# EAGLE schematic 8BIT_LOGIC_2 (EAGLE 6.5.0)

## Sheet 1 of 16
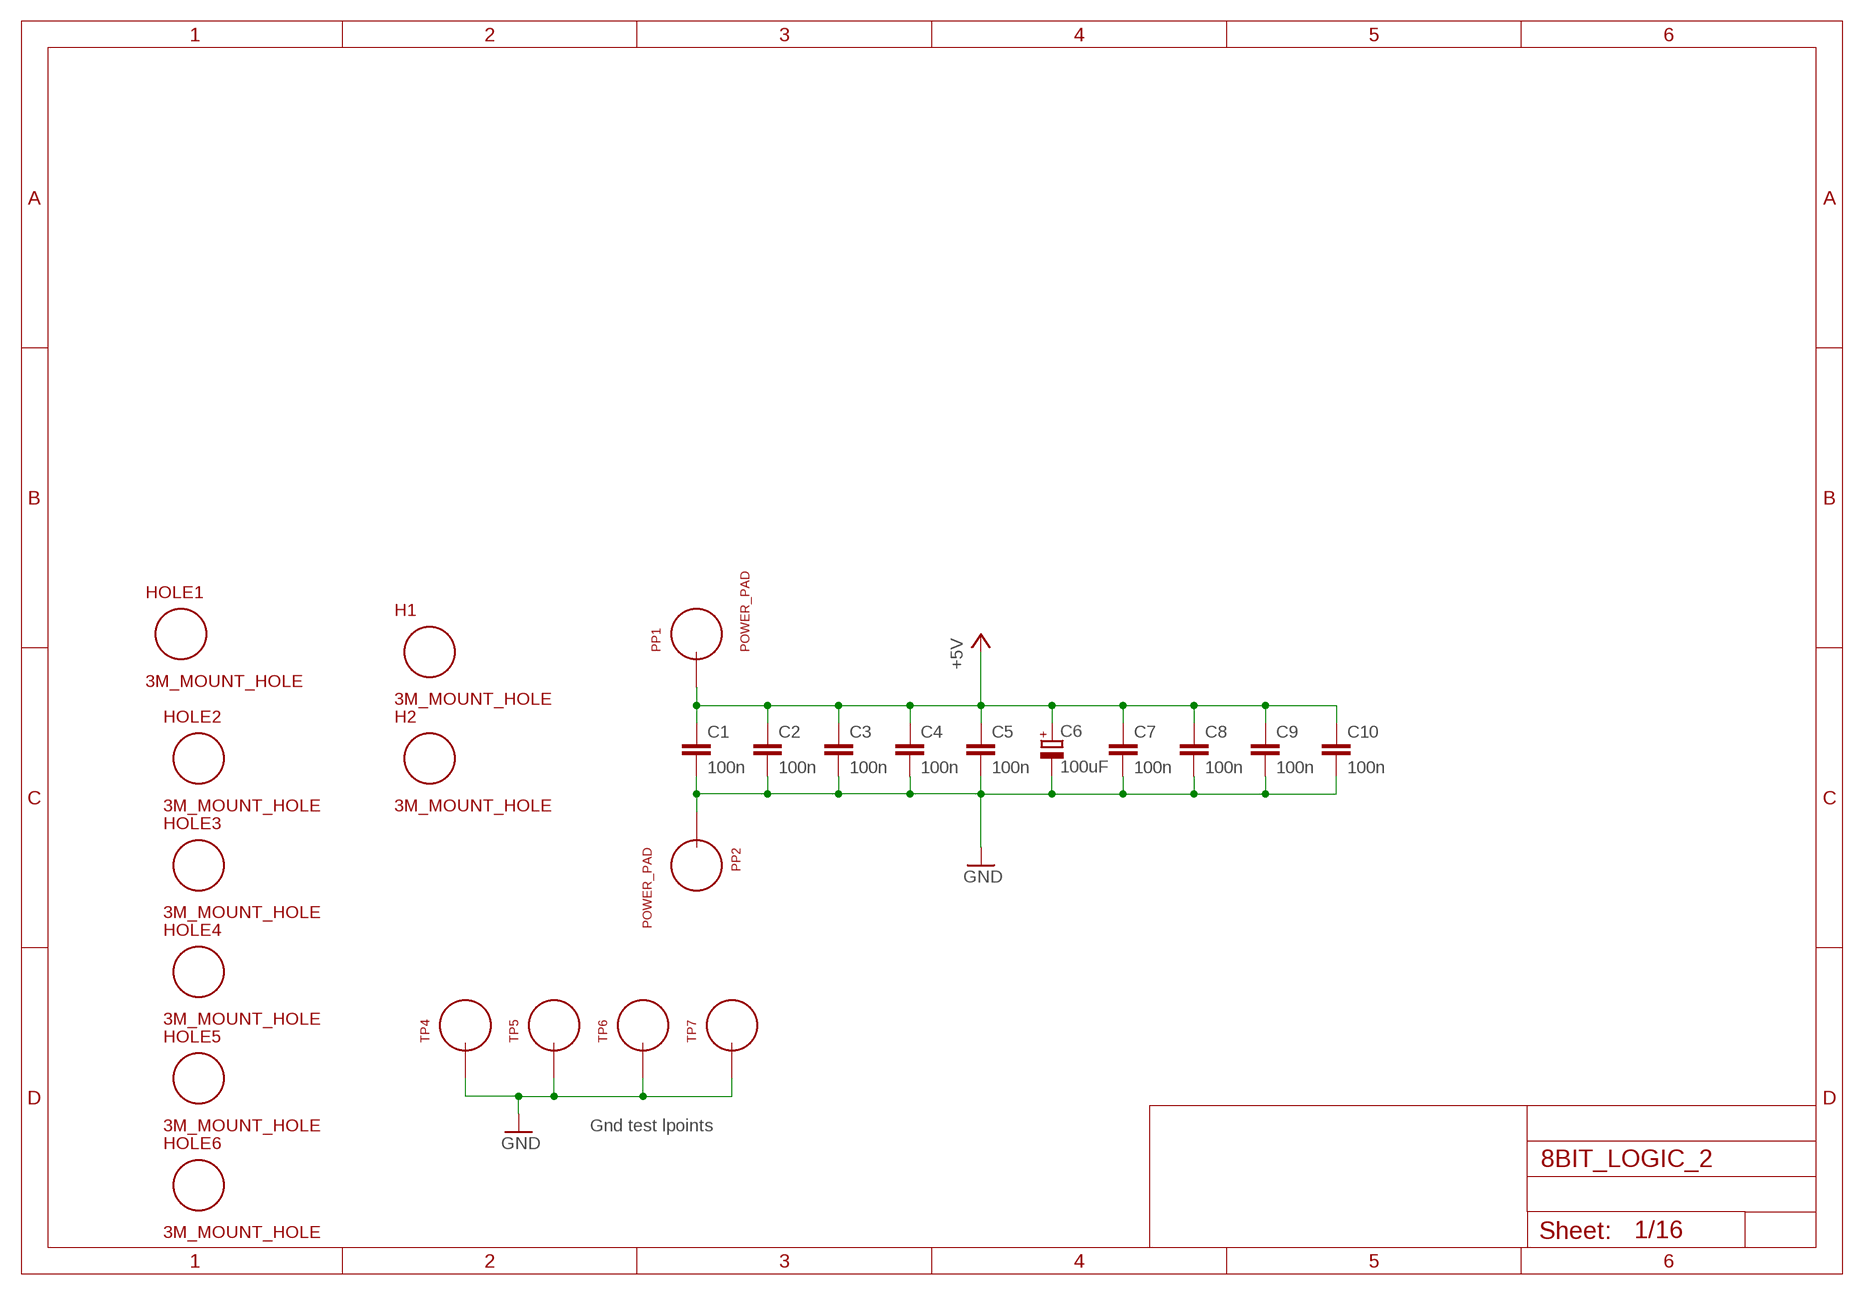
[diagram p0: schematic, sheet 1]

### Parts
C1  100n  C_P2INCH  [CAP_P2INCH]
C2  100n  C_P2INCH  [CAP_P2INCH]
C3  100n  C_P2INCH  [CAP_P2INCH]
C4  100n  C_P2INCH  [CAP_P2INCH]
C5  100n  C_P2INCH  [CAP_P2INCH]
C6  100uF  POLARISED_CAP_2P5  [POLARISED_CAP_2P5]
C7  100n  C_P2INCH  [CAP_P2INCH]
C8  100n  C_P2INCH  [CAP_P2INCH]
C9  100n  C_P2INCH  [CAP_P2INCH]
C10  100n  C_P2INCH  [CAP_P2INCH]
H1  3M_MOUNT_HOLE  [3M_HOLE]
H2  3M_MOUNT_HOLE  [3M_HOLE]
HOLE1  3M_MOUNT_HOLE  [3M_HOLE]
HOLE2  3M_MOUNT_HOLE  [3M_HOLE]
HOLE3  3M_MOUNT_HOLE  [3M_HOLE]
HOLE4  3M_MOUNT_HOLE  [3M_HOLE]
HOLE5  3M_MOUNT_HOLE  [3M_HOLE]
HOLE6  3M_MOUNT_HOLE  [3M_HOLE]
PP1  POWER_PAD  [POWER_PAD]
PP2  POWER_PAD  [POWER_PAD]
TP4  TEST_LOOP  [TEST_LOOP]
TP5  TEST_LOOP  [TEST_LOOP]
TP6  TEST_LOOP  [TEST_LOOP]
TP7  TEST_LOOP  [TEST_LOOP]

### Nets
+5V: C1.1 C2.1 C3.1 C4.1 C5.1 C6.A C7.1 C8.1 C9.1 C10.1 PP1.1 ; also sheet 2,3,4,5,6,7,8,9,10,11,12,14,15,16
GND: C1.2 C2.2 C3.2 C4.2 C5.2 C6.K C7.2 C8.2 C9.2 C10.2 PP2.1 TP4.P$1 TP5.P$1 TP6.P$1 TP7.P$1 ; also sheet 2,3,4,5,6,7,8,9,10,11,12,13,14,15,16

### Notes on the sheet
- Gnd test lpoints

## Sheet 2 of 16
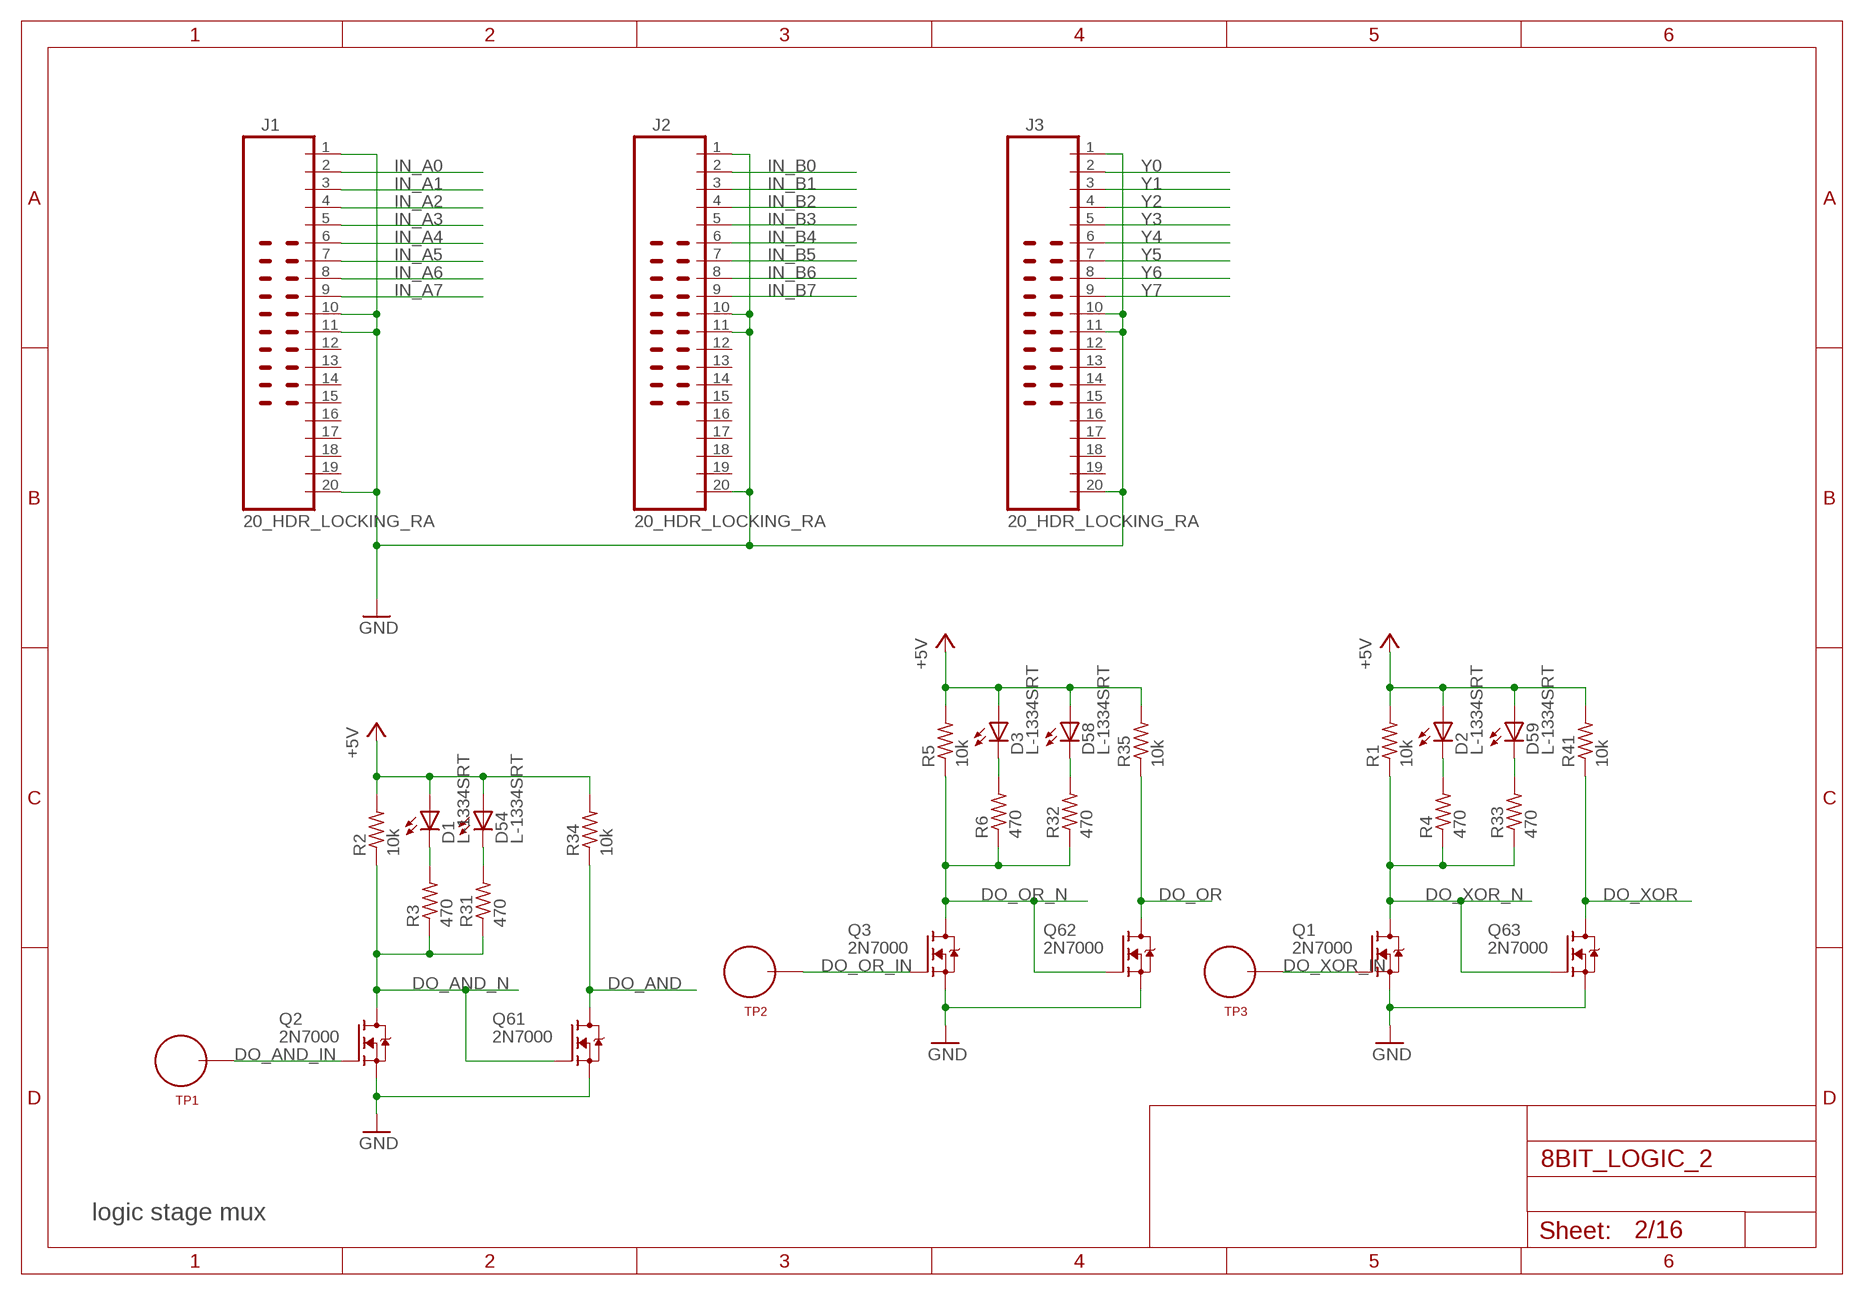
[diagram p1: schematic, sheet 2]

### Parts
D1  L-1334SRT  [LED3MM]
D2  L-1334SRT  [LED3MM]
D3  L-1334SRT  [LED3MM]
D54  L-1334SRT  [LED3MM]
D58  L-1334SRT  [LED3MM]
D59  L-1334SRT  [LED3MM]
J1  20_HDR_LOCKING_RA  [20_HDR_LOCKING_RA]
J2  20_HDR_LOCKING_RA  [20_HDR_LOCKING_RA]
J3  20_HDR_LOCKING_RA  [20_HDR_LOCKING_RA]
Q1  2N7000  [TO92-DGS]
Q2  2N7000  [TO92-DGS]
Q3  2N7000  [TO92-DGS]
Q61  2N7000  [TO92-DGS]
Q62  2N7000  [TO92-DGS]
Q63  2N7000  [TO92-DGS]
R1  10k  R_P2INCH  [R_P2INCH]
R2  10k  R_P2INCH  [R_P2INCH]
R3  470  R_P2INCH  [R_P2INCH]
R4  470  R_P2INCH  [R_P2INCH]
R5  10k  R_P2INCH  [R_P2INCH]
R6  470  R_P2INCH  [R_P2INCH]
R31  470  R_P2INCH  [R_P2INCH]
R32  470  R_P2INCH  [R_P2INCH]
R33  470  R_P2INCH  [R_P2INCH]
R34  10k  R_P2INCH  [R_P2INCH]
R35  10k  R_P2INCH  [R_P2INCH]
R41  10k  R_P2INCH  [R_P2INCH]
TP1  TEST_LOOP  [TEST_LOOP]
TP2  TEST_LOOP  [TEST_LOOP]
TP3  TEST_LOOP  [TEST_LOOP]

### Nets
+5V: D1.A D2.A D3.A D54.A D58.A D59.A R1.2 R2.2 R5.2 R34.2 R35.2 R41.2 ; also sheet 1,3,4,5,6,7,8,9,10,11,12,14,15,16
DO_AND: Q61.D R34.1 ; also sheet 14
DO_AND_IN: Q2.G TP1.P$1
DO_AND_N: Q2.D Q61.G R2.1 R3.1 R31.1
DO_OR: Q62.D R35.1 ; also sheet 16
DO_OR_IN: Q3.G TP2.P$1
DO_OR_N: Q3.D Q62.G R5.1 R6.1 R32.1
DO_XOR: Q63.D R41.1 ; also sheet 15
DO_XOR_IN: Q1.G TP3.P$1
DO_XOR_N: Q1.D Q63.G R1.1 R4.1 R33.1
GND: J1.1 J1.10 J1.11 J1.20 J2.1 J2.10 J2.11 J2.20 J3.1 J3.10 J3.11 J3.20 Q1.S Q2.S Q3.S Q61.S Q62.S Q63.S ; also sheet 1,3,4,5,6,7,8,9,10,11,12,13,14,15,16
IN_A0: J1.2 ; also sheet 3,4,13
IN_A1: J1.3 ; also sheet 3,5,13
IN_A2: J1.4 ; also sheet 3,6,13
IN_A3: J1.5 ; also sheet 3,7,13
IN_A4: J1.6 ; also sheet 3,8,13
IN_A5: J1.7 ; also sheet 3,9,13
IN_A6: J1.8 ; also sheet 3,10,13
IN_A7: J1.9 ; also sheet 3,11,13
IN_B0: J2.2 ; also sheet 3,4,13
IN_B1: J2.3 ; also sheet 3,5,13
IN_B2: J2.4 ; also sheet 3,6,13
IN_B3: J2.5 ; also sheet 3,7,13
IN_B4: J2.6 ; also sheet 3,8,13
IN_B5: J2.7 ; also sheet 3,9,13
IN_B6: J2.8 ; also sheet 3,10,13
IN_B7: J2.9 ; also sheet 3,11,13
N$1: D54.K(C) R31.2
N$2: D58.K(C) R32.2
N$3: D59.K(C) R33.2
N$5: D1.K(C) R3.2
N$6: D2.K(C) R4.2
N$7: D3.K(C) R6.2
Y0: J3.2 ; also sheet 12,13
Y1: J3.3 ; also sheet 12,13
Y2: J3.4 ; also sheet 12,13
Y3: J3.5 ; also sheet 12,13
Y4: J3.6 ; also sheet 12,13
Y5: J3.7 ; also sheet 12,13
Y6: J3.8 ; also sheet 12,13
Y7: J3.9 ; also sheet 12,13
Unconnected: J1.12 J1.13 J1.14 J1.15 J1.16 J1.17 J1.18 J1.19 J2.12 J2.13 J2.14 J2.15 J2.16 J2.17 J2.18 J2.19 J3.12 J3.13 J3.14 J3.15 J3.16 J3.17 J3.18 J3.19

### Notes on the sheet
- logic stage mux

## Sheet 3 of 16
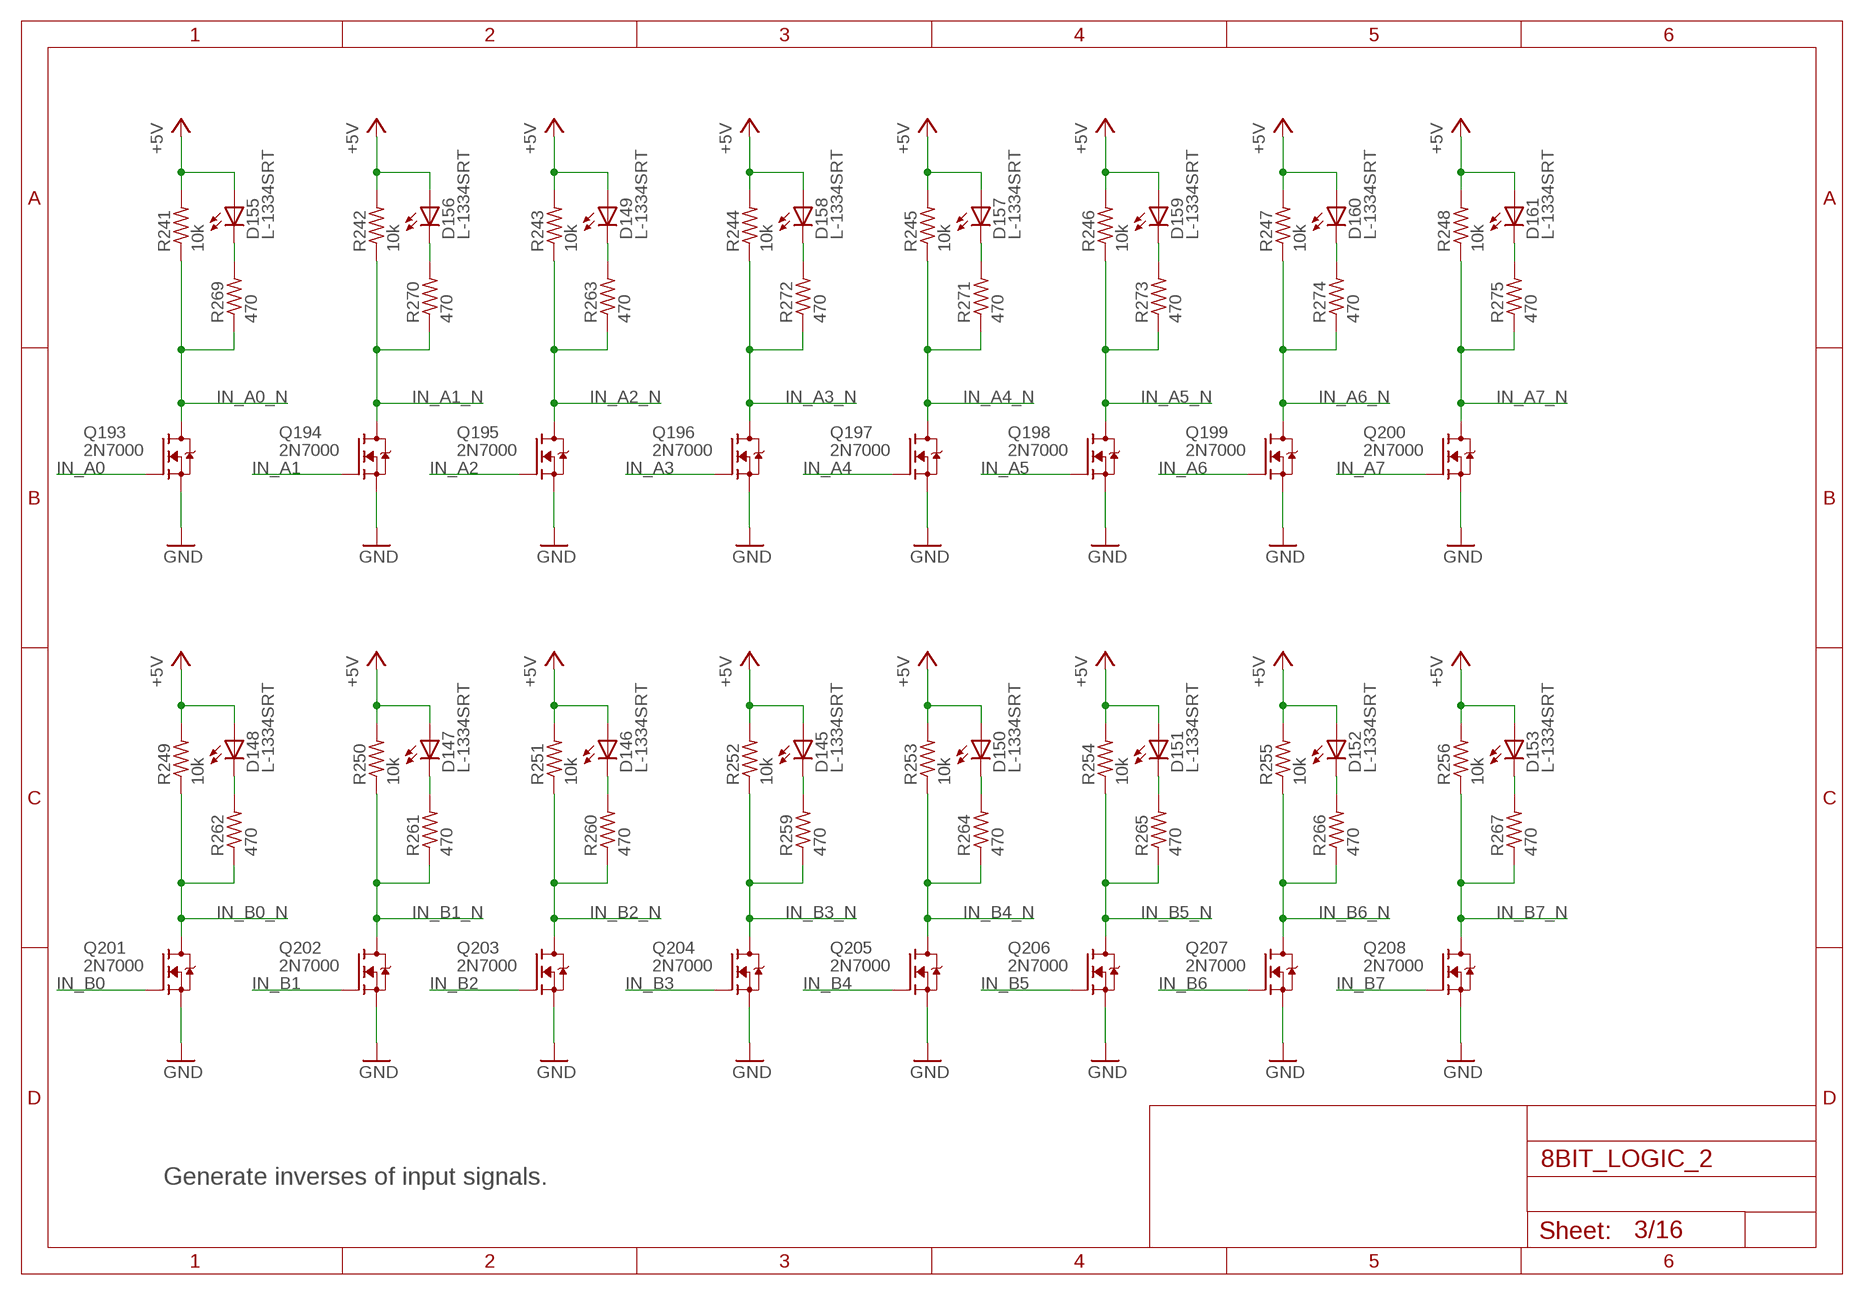
[diagram p2: schematic, sheet 3]

### Parts
D145  L-1334SRT  [LED3MM]
D146  L-1334SRT  [LED3MM]
D147  L-1334SRT  [LED3MM]
D148  L-1334SRT  [LED3MM]
D149  L-1334SRT  [LED3MM]
D150  L-1334SRT  [LED3MM]
D151  L-1334SRT  [LED3MM]
D152  L-1334SRT  [LED3MM]
D153  L-1334SRT  [LED3MM]
D155  L-1334SRT  [LED3MM]
D156  L-1334SRT  [LED3MM]
D157  L-1334SRT  [LED3MM]
D158  L-1334SRT  [LED3MM]
D159  L-1334SRT  [LED3MM]
D160  L-1334SRT  [LED3MM]
D161  L-1334SRT  [LED3MM]
Q193  2N7000  [TO92-DGS]
Q194  2N7000  [TO92-DGS]
Q195  2N7000  [TO92-DGS]
Q196  2N7000  [TO92-DGS]
Q197  2N7000  [TO92-DGS]
Q198  2N7000  [TO92-DGS]
Q199  2N7000  [TO92-DGS]
Q200  2N7000  [TO92-DGS]
Q201  2N7000  [TO92-DGS]
Q202  2N7000  [TO92-DGS]
Q203  2N7000  [TO92-DGS]
Q204  2N7000  [TO92-DGS]
Q205  2N7000  [TO92-DGS]
Q206  2N7000  [TO92-DGS]
Q207  2N7000  [TO92-DGS]
Q208  2N7000  [TO92-DGS]
R241  10k  R_P2INCH  [R_P2INCH]
R242  10k  R_P2INCH  [R_P2INCH]
R243  10k  R_P2INCH  [R_P2INCH]
R244  10k  R_P2INCH  [R_P2INCH]
R245  10k  R_P2INCH  [R_P2INCH]
R246  10k  R_P2INCH  [R_P2INCH]
R247  10k  R_P2INCH  [R_P2INCH]
R248  10k  R_P2INCH  [R_P2INCH]
R249  10k  R_P2INCH  [R_P2INCH]
R250  10k  R_P2INCH  [R_P2INCH]
R251  10k  R_P2INCH  [R_P2INCH]
R252  10k  R_P2INCH  [R_P2INCH]
R253  10k  R_P2INCH  [R_P2INCH]
R254  10k  R_P2INCH  [R_P2INCH]
R255  10k  R_P2INCH  [R_P2INCH]
R256  10k  R_P2INCH  [R_P2INCH]
R259  470  R_P2INCH  [R_P2INCH]
R260  470  R_P2INCH  [R_P2INCH]
R261  470  R_P2INCH  [R_P2INCH]
R262  470  R_P2INCH  [R_P2INCH]
R263  470  R_P2INCH  [R_P2INCH]
R264  470  R_P2INCH  [R_P2INCH]
R265  470  R_P2INCH  [R_P2INCH]
R266  470  R_P2INCH  [R_P2INCH]
R267  470  R_P2INCH  [R_P2INCH]
R269  470  R_P2INCH  [R_P2INCH]
R270  470  R_P2INCH  [R_P2INCH]
R271  470  R_P2INCH  [R_P2INCH]
R272  470  R_P2INCH  [R_P2INCH]
R273  470  R_P2INCH  [R_P2INCH]
R274  470  R_P2INCH  [R_P2INCH]
R275  470  R_P2INCH  [R_P2INCH]

### Nets
+5V: D145.A D146.A D147.A D148.A D149.A D150.A D151.A D152.A D153.A D155.A D156.A D157.A D158.A D159.A D160.A D161.A R241.2 R242.2 R243.2 R244.2 R245.2 R246.2 R247.2 R248.2 R249.2 R250.2 R251.2 R252.2 R253.2 R254.2 R255.2 R256.2 ; also sheet 1,2,4,5,6,7,8,9,10,11,12,14,15,16
GND: Q193.S Q194.S Q195.S Q196.S Q197.S Q198.S Q199.S Q200.S Q201.S Q202.S Q203.S Q204.S Q205.S Q206.S Q207.S Q208.S ; also sheet 1,2,4,5,6,7,8,9,10,11,12,13,14,15,16
IN_A0: Q193.G ; also sheet 2,4,13
IN_A0_N: Q193.D R241.1 R269.1 ; also sheet 4
IN_A1: Q194.G ; also sheet 2,5,13
IN_A1_N: Q194.D R242.1 R270.1 ; also sheet 5
IN_A2: Q195.G ; also sheet 2,6,13
IN_A2_N: Q195.D R243.1 R263.1 ; also sheet 6
IN_A3: Q196.G ; also sheet 2,7,13
IN_A3_N: Q196.D R244.1 R272.1 ; also sheet 7
IN_A4: Q197.G ; also sheet 2,8,13
IN_A4_N: Q197.D R245.1 R271.1 ; also sheet 8
IN_A5: Q198.G ; also sheet 2,9,13
IN_A5_N: Q198.D R246.1 R273.1 ; also sheet 9
IN_A6: Q199.G ; also sheet 2,10,13
IN_A6_N: Q199.D R247.1 R274.1 ; also sheet 10
IN_A7: Q200.G ; also sheet 2,11,13
IN_A7_N: Q200.D R248.1 R275.1 ; also sheet 11
IN_B0: Q201.G ; also sheet 2,4,13
IN_B0_N: Q201.D R249.1 R262.1 ; also sheet 4
IN_B1: Q202.G ; also sheet 2,5,13
IN_B1_N: Q202.D R250.1 R261.1 ; also sheet 5
IN_B2: Q203.G ; also sheet 2,6,13
IN_B2_N: Q203.D R251.1 R260.1 ; also sheet 6
IN_B3: Q204.G ; also sheet 2,7,13
IN_B3_N: Q204.D R252.1 R259.1 ; also sheet 7
IN_B4: Q205.G ; also sheet 2,8,13
IN_B4_N: Q205.D R253.1 R264.1 ; also sheet 8
IN_B5: Q206.G ; also sheet 2,9,13
IN_B5_N: Q206.D R254.1 R265.1 ; also sheet 9
IN_B6: Q207.G ; also sheet 2,10,13
IN_B6_N: Q207.D R255.1 R266.1 ; also sheet 10
IN_B7: Q208.G ; also sheet 2,11,13
IN_B7_N: Q208.D R256.1 R267.1 ; also sheet 11
N$240: D145.K(C) R259.2
N$241: D146.K(C) R260.2
N$242: D147.K(C) R261.2
N$243: D148.K(C) R262.2
N$244: D149.K(C) R263.2
N$245: D150.K(C) R264.2
N$246: D151.K(C) R265.2
N$247: D152.K(C) R266.2
N$248: D153.K(C) R267.2
N$250: D155.K(C) R269.2
N$251: D156.K(C) R270.2
N$252: D157.K(C) R271.2
N$253: D158.K(C) R272.2
N$254: D159.K(C) R273.2
N$255: D160.K(C) R274.2
N$256: D161.K(C) R275.2

### Notes on the sheet
- Generate inverses of input signals.

## Sheet 4 of 16
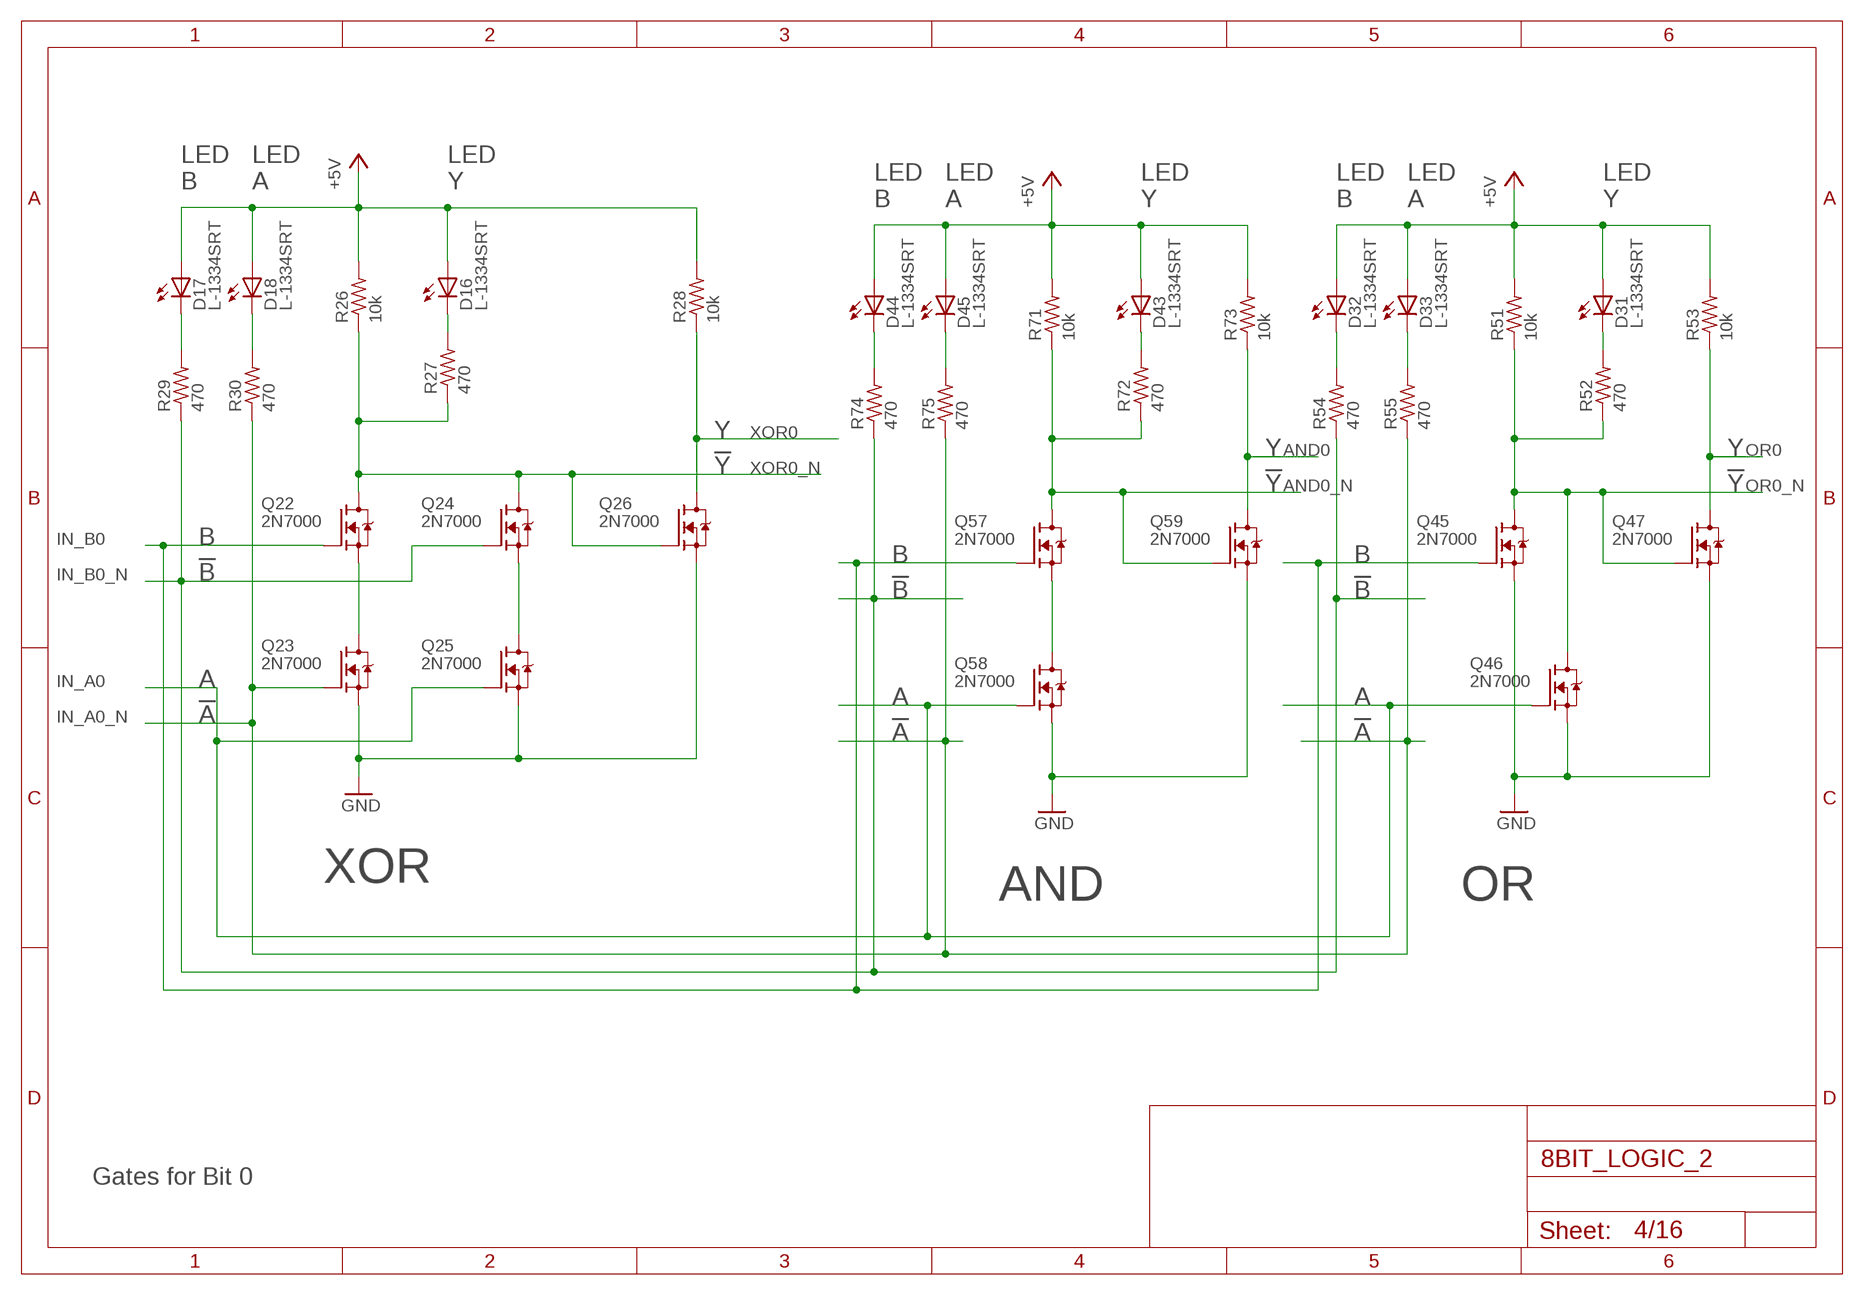
[diagram p3: schematic, sheet 4]

### Parts
D16  L-1334SRT  [LED3MM]
D17  L-1334SRT  [LED3MM]
D18  L-1334SRT  [LED3MM]
D31  L-1334SRT  [LED3MM]
D32  L-1334SRT  [LED3MM]
D33  L-1334SRT  [LED3MM]
D43  L-1334SRT  [LED3MM]
D44  L-1334SRT  [LED3MM]
D45  L-1334SRT  [LED3MM]
Q22  2N7000  [TO92-DGS]
Q23  2N7000  [TO92-DGS]
Q24  2N7000  [TO92-DGS]
Q25  2N7000  [TO92-DGS]
Q26  2N7000  [TO92-DGS]
Q45  2N7000  [TO92-DGS]
Q46  2N7000  [TO92-DGS]
Q47  2N7000  [TO92-DGS]
Q57  2N7000  [TO92-DGS]
Q58  2N7000  [TO92-DGS]
Q59  2N7000  [TO92-DGS]
R26  10k  R_P2INCH  [R_P2INCH]
R27  470  R_P2INCH  [R_P2INCH]
R28  10k  R_P2INCH  [R_P2INCH]
R29  470  R_P2INCH  [R_P2INCH]
R30  470  R_P2INCH  [R_P2INCH]
R51  10k  R_P2INCH  [R_P2INCH]
R52  470  R_P2INCH  [R_P2INCH]
R53  10k  R_P2INCH  [R_P2INCH]
R54  470  R_P2INCH  [R_P2INCH]
R55  470  R_P2INCH  [R_P2INCH]
R71  10k  R_P2INCH  [R_P2INCH]
R72  470  R_P2INCH  [R_P2INCH]
R73  10k  R_P2INCH  [R_P2INCH]
R74  470  R_P2INCH  [R_P2INCH]
R75  470  R_P2INCH  [R_P2INCH]

### Nets
+5V: D16.A D17.A D18.A D31.A D32.A D33.A D43.A D44.A D45.A R26.2 R28.2 R51.2 R53.2 R71.2 R73.2 ; also sheet 1,2,3,5,6,7,8,9,10,11,12,14,15,16
AND0: Q59.D R73.1 ; also sheet 14
AND0_N: Q57.D Q59.G R71.1 R72.1 ; also sheet 14
GND: Q23.S Q25.S Q26.S Q45.S Q46.S Q47.S Q58.S Q59.S ; also sheet 1,2,3,5,6,7,8,9,10,11,12,13,14,15,16
IN_A0: Q25.G Q46.G Q58.G ; also sheet 2,3,13
IN_A0_N: Q23.G R30.1 R55.1 R75.1 ; also sheet 3
IN_B0: Q22.G Q45.G Q57.G ; also sheet 2,3,13
IN_B0_N: Q24.G R29.1 R54.1 R74.1 ; also sheet 3
N$53: Q22.S Q23.D
N$54: Q24.S Q25.D
N$58: D16.K(C) R27.2
N$61: D18.K(C) R30.2
N$62: D17.K(C) R29.2
N$109: D31.K(C) R52.2
N$114: D33.K(C) R55.2
N$115: D32.K(C) R54.2
N$145: Q57.S Q58.D
N$148: D43.K(C) R72.2
N$153: D45.K(C) R75.2
N$154: D44.K(C) R74.2
OR0: Q47.D R53.1 ; also sheet 16
OR0_N: Q45.D Q46.D Q47.G R51.1 R52.1 ; also sheet 16
XOR0: Q26.D R28.1 ; also sheet 15
XOR0_N: Q22.D Q24.D Q26.G R26.1 R27.1 ; also sheet 15

### Notes on the sheet
- LED
  B
- LED
  A
- LED
  Y
- LED
  B
- LED
  A
- LED
  Y
- LED
  B
- LED
  A
- LED
  Y
- Y
- Y | Y
- !Y
- !Y | !Y
- B
- B | B
- !B
- !B | !B
- A
- A | A
- !A
- !A | !A
- XOR
- AND | OR
- Gates for Bit 0

## Sheet 5 of 16
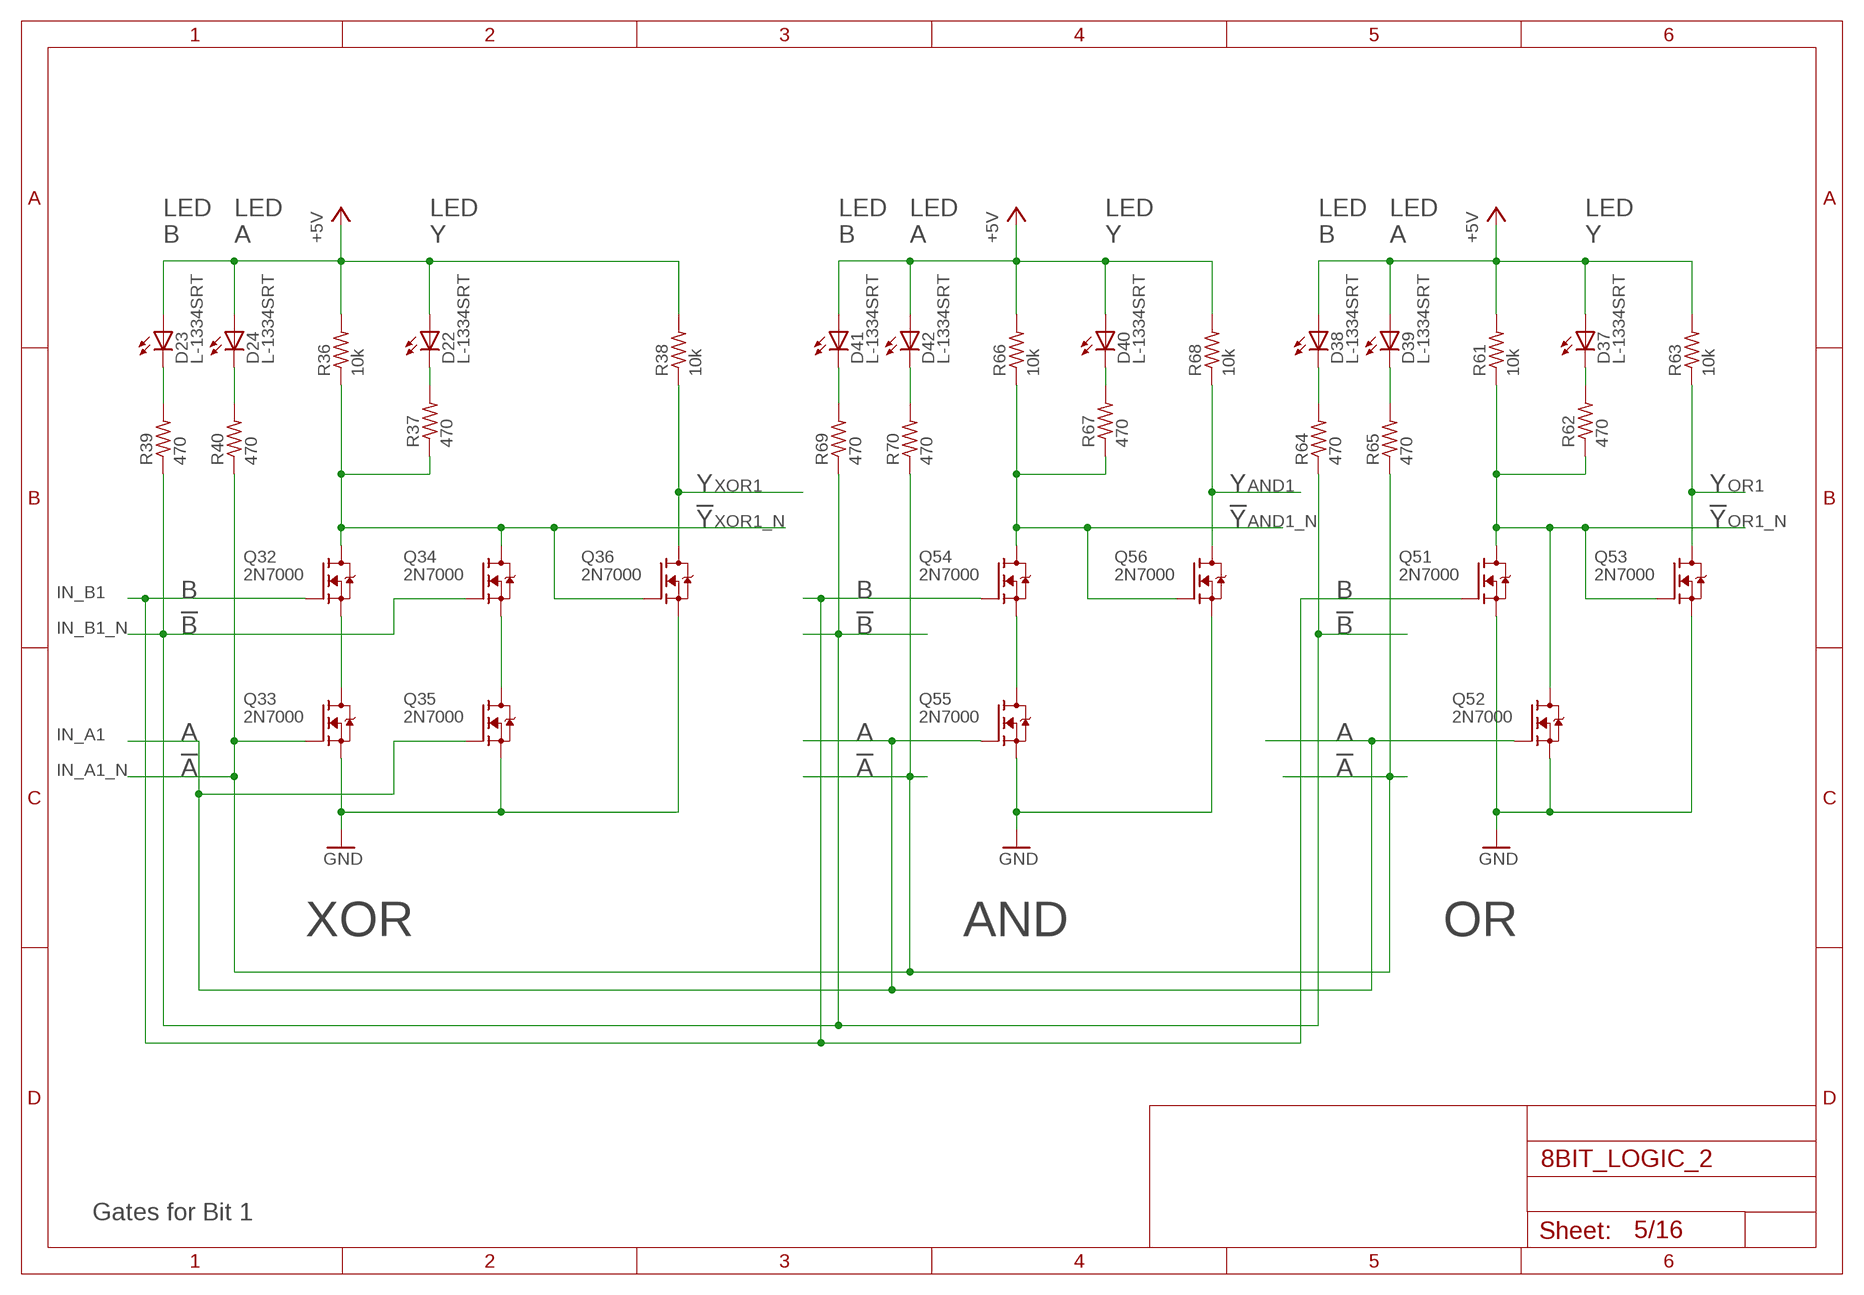
[diagram p4: schematic, sheet 5]

### Parts
D22  L-1334SRT  [LED3MM]
D23  L-1334SRT  [LED3MM]
D24  L-1334SRT  [LED3MM]
D37  L-1334SRT  [LED3MM]
D38  L-1334SRT  [LED3MM]
D39  L-1334SRT  [LED3MM]
D40  L-1334SRT  [LED3MM]
D41  L-1334SRT  [LED3MM]
D42  L-1334SRT  [LED3MM]
Q32  2N7000  [TO92-DGS]
Q33  2N7000  [TO92-DGS]
Q34  2N7000  [TO92-DGS]
Q35  2N7000  [TO92-DGS]
Q36  2N7000  [TO92-DGS]
Q51  2N7000  [TO92-DGS]
Q52  2N7000  [TO92-DGS]
Q53  2N7000  [TO92-DGS]
Q54  2N7000  [TO92-DGS]
Q55  2N7000  [TO92-DGS]
Q56  2N7000  [TO92-DGS]
R36  10k  R_P2INCH  [R_P2INCH]
R37  470  R_P2INCH  [R_P2INCH]
R38  10k  R_P2INCH  [R_P2INCH]
R39  470  R_P2INCH  [R_P2INCH]
R40  470  R_P2INCH  [R_P2INCH]
R61  10k  R_P2INCH  [R_P2INCH]
R62  470  R_P2INCH  [R_P2INCH]
R63  10k  R_P2INCH  [R_P2INCH]
R64  470  R_P2INCH  [R_P2INCH]
R65  470  R_P2INCH  [R_P2INCH]
R66  10k  R_P2INCH  [R_P2INCH]
R67  470  R_P2INCH  [R_P2INCH]
R68  10k  R_P2INCH  [R_P2INCH]
R69  470  R_P2INCH  [R_P2INCH]
R70  470  R_P2INCH  [R_P2INCH]

### Nets
+5V: D22.A D23.A D24.A D37.A D38.A D39.A D40.A D41.A D42.A R36.2 R38.2 R61.2 R63.2 R66.2 R68.2 ; also sheet 1,2,3,4,6,7,8,9,10,11,12,14,15,16
AND1: Q56.D R68.1 ; also sheet 14
AND1_N: Q54.D Q56.G R66.1 R67.1 ; also sheet 14
GND: Q33.S Q35.S Q36.S Q51.S Q52.S Q53.S Q55.S Q56.S ; also sheet 1,2,3,4,6,7,8,9,10,11,12,13,14,15,16
IN_A1: Q35.G Q52.G Q55.G ; also sheet 2,3,13
IN_A1_N: Q33.G R40.1 R65.1 R70.1 ; also sheet 3
IN_B1: Q32.G Q51.G Q54.G ; also sheet 2,3,13
IN_B1_N: Q34.G R39.1 R64.1 R69.1 ; also sheet 3
N$75: Q32.S Q33.D
N$76: Q34.S Q35.D
N$80: D22.K(C) R37.2
N$83: D24.K(C) R40.2
N$84: D23.K(C) R39.2
N$128: D37.K(C) R62.2
N$133: D39.K(C) R65.2
N$134: D38.K(C) R64.2
N$135: Q54.S Q55.D
N$138: D40.K(C) R67.2
N$143: D42.K(C) R70.2
N$144: D41.K(C) R69.2
OR1: Q53.D R63.1 ; also sheet 16
OR1_N: Q51.D Q52.D Q53.G R61.1 R62.1 ; also sheet 16
XOR1: Q36.D R38.1 ; also sheet 15
XOR1_N: Q32.D Q34.D Q36.G R36.1 R37.1 ; also sheet 15

### Notes on the sheet
- LED
  B
- LED
  A
- LED
  Y
- LED
  B
- LED
  A
- LED
  Y
- LED
  B
- LED
  A
- LED
  Y
- Y | Y | Y
- !Y | !Y | !Y
- B | B | B
- !B | !B | !B
- A | A | A
- !A | !A | !A
- XOR | AND | OR
- Gates for Bit 1

## Sheet 6 of 16
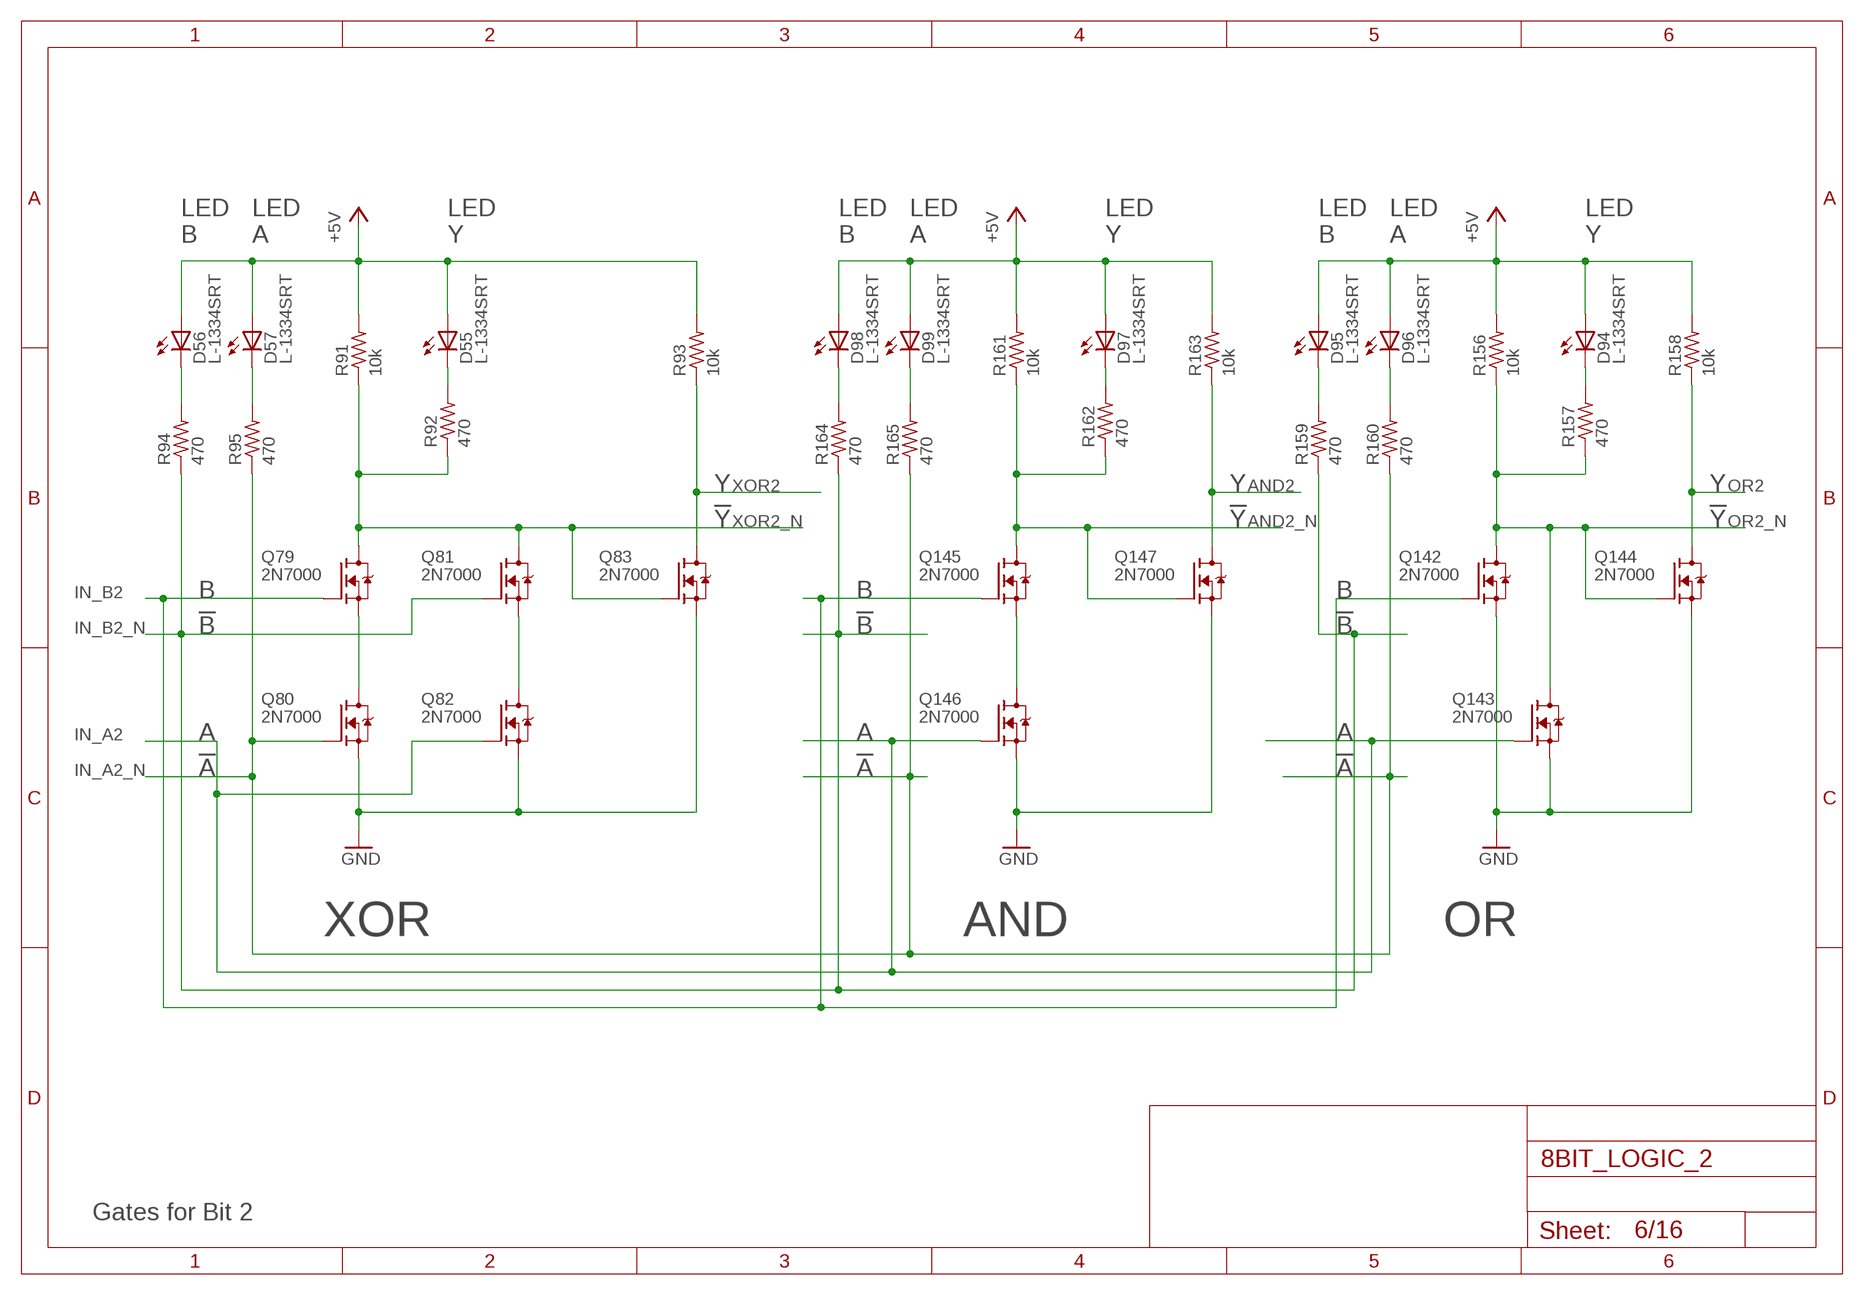
[diagram p5: schematic, sheet 6]

### Parts
D55  L-1334SRT  [LED3MM]
D56  L-1334SRT  [LED3MM]
D57  L-1334SRT  [LED3MM]
D94  L-1334SRT  [LED3MM]
D95  L-1334SRT  [LED3MM]
D96  L-1334SRT  [LED3MM]
D97  L-1334SRT  [LED3MM]
D98  L-1334SRT  [LED3MM]
D99  L-1334SRT  [LED3MM]
Q79  2N7000  [TO92-DGS]
Q80  2N7000  [TO92-DGS]
Q81  2N7000  [TO92-DGS]
Q82  2N7000  [TO92-DGS]
Q83  2N7000  [TO92-DGS]
Q142  2N7000  [TO92-DGS]
Q143  2N7000  [TO92-DGS]
Q144  2N7000  [TO92-DGS]
Q145  2N7000  [TO92-DGS]
Q146  2N7000  [TO92-DGS]
Q147  2N7000  [TO92-DGS]
R91  10k  R_P2INCH  [R_P2INCH]
R92  470  R_P2INCH  [R_P2INCH]
R93  10k  R_P2INCH  [R_P2INCH]
R94  470  R_P2INCH  [R_P2INCH]
R95  470  R_P2INCH  [R_P2INCH]
R156  10k  R_P2INCH  [R_P2INCH]
R157  470  R_P2INCH  [R_P2INCH]
R158  10k  R_P2INCH  [R_P2INCH]
R159  470  R_P2INCH  [R_P2INCH]
R160  470  R_P2INCH  [R_P2INCH]
R161  10k  R_P2INCH  [R_P2INCH]
R162  470  R_P2INCH  [R_P2INCH]
R163  10k  R_P2INCH  [R_P2INCH]
R164  470  R_P2INCH  [R_P2INCH]
R165  470  R_P2INCH  [R_P2INCH]

### Nets
+5V: D55.A D56.A D57.A D94.A D95.A D96.A D97.A D98.A D99.A R91.2 R93.2 R156.2 R158.2 R161.2 R163.2 ; also sheet 1,2,3,4,5,7,8,9,10,11,12,14,15,16
AND2: Q147.D R163.1 ; also sheet 14
AND2_N: Q145.D Q147.G R161.1 R162.1 ; also sheet 14
GND: Q80.S Q82.S Q83.S Q142.S Q143.S Q144.S Q146.S Q147.S ; also sheet 1,2,3,4,5,7,8,9,10,11,12,13,14,15,16
IN_A2: Q82.G Q143.G Q146.G ; also sheet 2,3,13
IN_A2_N: Q80.G R95.1 R160.1 R165.1 ; also sheet 3
IN_B2: Q79.G Q142.G Q145.G ; also sheet 2,3,13
IN_B2_N: Q81.G R94.1 R159.1 R164.1 ; also sheet 3
N$33: Q79.S Q80.D
N$34: Q81.S Q82.D
N$35: D55.K(C) R92.2
N$37: D57.K(C) R95.2
N$38: D56.K(C) R94.2
N$156: D94.K(C) R157.2
N$157: D96.K(C) R160.2
N$158: D95.K(C) R159.2
N$159: Q145.S Q146.D
N$160: D97.K(C) R162.2
N$163: D99.K(C) R165.2
N$164: D98.K(C) R164.2
OR2: Q144.D R158.1 ; also sheet 16
OR2_N: Q142.D Q143.D Q144.G R156.1 R157.1 ; also sheet 16
XOR2: Q83.D R93.1 ; also sheet 15
XOR2_N: Q79.D Q81.D Q83.G R91.1 R92.1 ; also sheet 15

### Notes on the sheet
- LED
  B
- LED
  A
- LED
  Y
- LED
  B
- LED
  A
- LED
  Y
- LED
  B
- LED
  A
- LED
  Y
- Y | Y | Y
- !Y | !Y | !Y
- B | B | B
- !B | !B | !B
- A | A | A
- !A | !A | !A
- XOR | AND | OR
- Gates for Bit 2

## Sheet 7 of 16
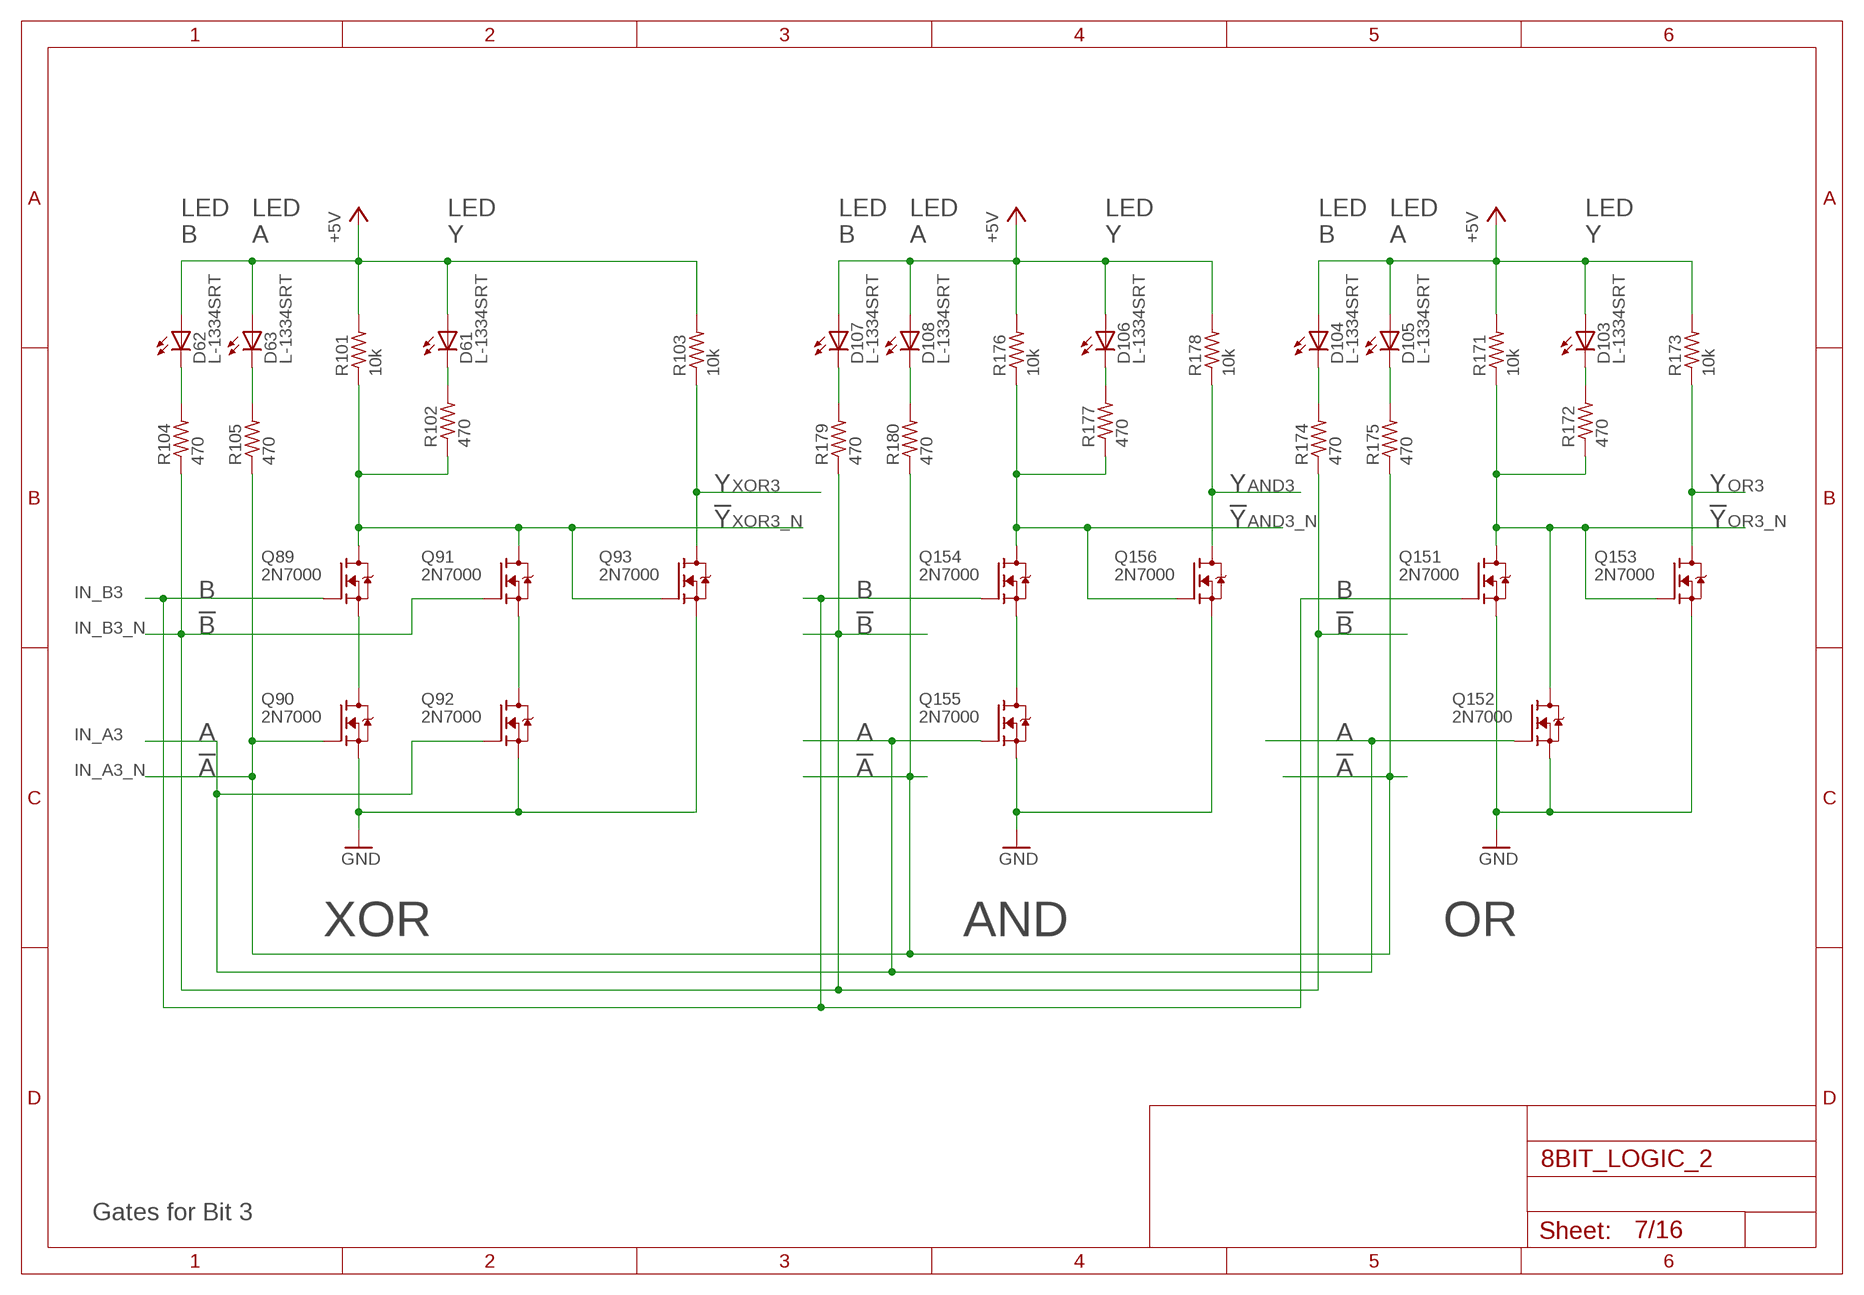
[diagram p6: schematic, sheet 7]

### Parts
D61  L-1334SRT  [LED3MM]
D62  L-1334SRT  [LED3MM]
D63  L-1334SRT  [LED3MM]
D103  L-1334SRT  [LED3MM]
D104  L-1334SRT  [LED3MM]
D105  L-1334SRT  [LED3MM]
D106  L-1334SRT  [LED3MM]
D107  L-1334SRT  [LED3MM]
D108  L-1334SRT  [LED3MM]
Q89  2N7000  [TO92-DGS]
Q90  2N7000  [TO92-DGS]
Q91  2N7000  [TO92-DGS]
Q92  2N7000  [TO92-DGS]
Q93  2N7000  [TO92-DGS]
Q151  2N7000  [TO92-DGS]
Q152  2N7000  [TO92-DGS]
Q153  2N7000  [TO92-DGS]
Q154  2N7000  [TO92-DGS]
Q155  2N7000  [TO92-DGS]
Q156  2N7000  [TO92-DGS]
R101  10k  R_P2INCH  [R_P2INCH]
R102  470  R_P2INCH  [R_P2INCH]
R103  10k  R_P2INCH  [R_P2INCH]
R104  470  R_P2INCH  [R_P2INCH]
R105  470  R_P2INCH  [R_P2INCH]
R171  10k  R_P2INCH  [R_P2INCH]
R172  470  R_P2INCH  [R_P2INCH]
R173  10k  R_P2INCH  [R_P2INCH]
R174  470  R_P2INCH  [R_P2INCH]
R175  470  R_P2INCH  [R_P2INCH]
R176  10k  R_P2INCH  [R_P2INCH]
R177  470  R_P2INCH  [R_P2INCH]
R178  10k  R_P2INCH  [R_P2INCH]
R179  470  R_P2INCH  [R_P2INCH]
R180  470  R_P2INCH  [R_P2INCH]

### Nets
+5V: D61.A D62.A D63.A D103.A D104.A D105.A D106.A D107.A D108.A R101.2 R103.2 R171.2 R173.2 R176.2 R178.2 ; also sheet 1,2,3,4,5,6,8,9,10,11,12,14,15,16
AND3: Q156.D R178.1 ; also sheet 14
AND3_N: Q154.D Q156.G R176.1 R177.1 ; also sheet 14
GND: Q90.S Q92.S Q93.S Q151.S Q152.S Q153.S Q155.S Q156.S ; also sheet 1,2,3,4,5,6,8,9,10,11,12,13,14,15,16
IN_A3: Q92.G Q152.G Q155.G ; also sheet 2,3,13
IN_A3_N: Q90.G R105.1 R175.1 R180.1 ; also sheet 3
IN_B3: Q89.G Q151.G Q154.G ; also sheet 2,3,13
IN_B3_N: Q91.G R104.1 R174.1 R179.1 ; also sheet 3
N$49: Q89.S Q90.D
N$52: Q91.S Q92.D
N$55: D61.K(C) R102.2
N$56: D63.K(C) R105.2
N$57: D62.K(C) R104.2
N$171: D103.K(C) R172.2
N$172: D105.K(C) R175.2
N$173: D104.K(C) R174.2
N$174: Q154.S Q155.D
N$175: D106.K(C) R177.2
N$178: D108.K(C) R180.2
N$179: D107.K(C) R179.2
OR3: Q153.D R173.1 ; also sheet 16
OR3_N: Q151.D Q152.D Q153.G R171.1 R172.1 ; also sheet 16
XOR3: Q93.D R103.1 ; also sheet 15
XOR3_N: Q89.D Q91.D Q93.G R101.1 R102.1 ; also sheet 15

### Notes on the sheet
- LED
  B
- LED
  A
- LED
  Y
- LED
  B
- LED
  A
- LED
  Y
- LED
  B
- LED
  A
- LED
  Y
- Y | Y | Y
- !Y | !Y | !Y
- B | B | B
- !B | !B | !B
- A | A | A
- !A | !A | !A
- XOR | AND | OR
- Gates for Bit 3

## Sheet 8 of 16
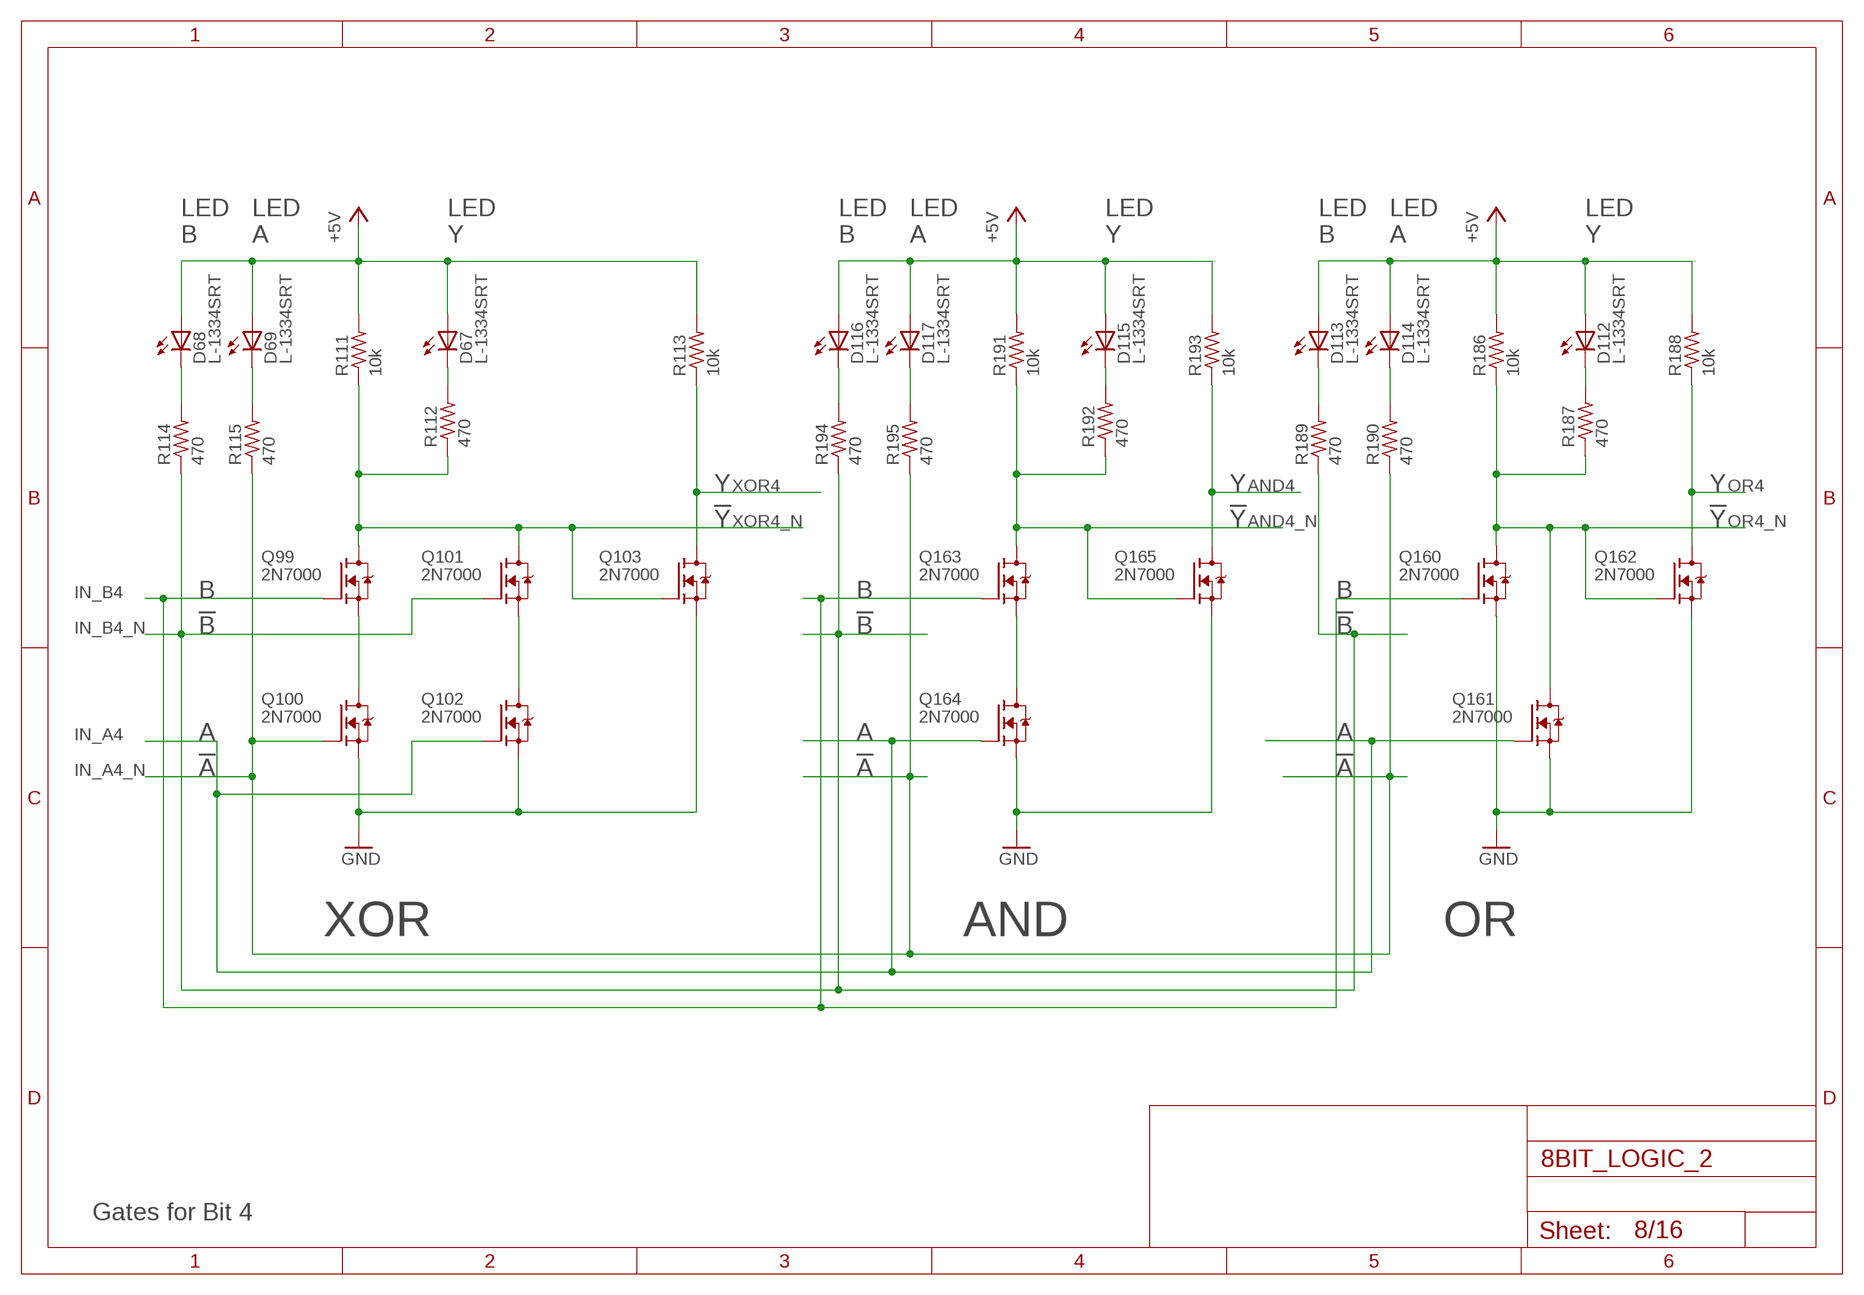
[diagram p7: schematic, sheet 8]

### Parts
D67  L-1334SRT  [LED3MM]
D68  L-1334SRT  [LED3MM]
D69  L-1334SRT  [LED3MM]
D112  L-1334SRT  [LED3MM]
D113  L-1334SRT  [LED3MM]
D114  L-1334SRT  [LED3MM]
D115  L-1334SRT  [LED3MM]
D116  L-1334SRT  [LED3MM]
D117  L-1334SRT  [LED3MM]
Q99  2N7000  [TO92-DGS]
Q100  2N7000  [TO92-DGS]
Q101  2N7000  [TO92-DGS]
Q102  2N7000  [TO92-DGS]
Q103  2N7000  [TO92-DGS]
Q160  2N7000  [TO92-DGS]
Q161  2N7000  [TO92-DGS]
Q162  2N7000  [TO92-DGS]
Q163  2N7000  [TO92-DGS]
Q164  2N7000  [TO92-DGS]
Q165  2N7000  [TO92-DGS]
R111  10k  R_P2INCH  [R_P2INCH]
R112  470  R_P2INCH  [R_P2INCH]
R113  10k  R_P2INCH  [R_P2INCH]
R114  470  R_P2INCH  [R_P2INCH]
R115  470  R_P2INCH  [R_P2INCH]
R186  10k  R_P2INCH  [R_P2INCH]
R187  470  R_P2INCH  [R_P2INCH]
R188  10k  R_P2INCH  [R_P2INCH]
R189  470  R_P2INCH  [R_P2INCH]
R190  470  R_P2INCH  [R_P2INCH]
R191  10k  R_P2INCH  [R_P2INCH]
R192  470  R_P2INCH  [R_P2INCH]
R193  10k  R_P2INCH  [R_P2INCH]
R194  470  R_P2INCH  [R_P2INCH]
R195  470  R_P2INCH  [R_P2INCH]

### Nets
+5V: D67.A D68.A D69.A D112.A D113.A D114.A D115.A D116.A D117.A R111.2 R113.2 R186.2 R188.2 R191.2 R193.2 ; also sheet 1,2,3,4,5,6,7,9,10,11,12,14,15,16
AND4: Q165.D R193.1 ; also sheet 14
AND4_N: Q163.D Q165.G R191.1 R192.1 ; also sheet 14
GND: Q100.S Q102.S Q103.S Q160.S Q161.S Q162.S Q164.S Q165.S ; also sheet 1,2,3,4,5,6,7,9,10,11,12,13,14,15,16
IN_A4: Q102.G Q161.G Q164.G ; also sheet 2,3,13
IN_A4_N: Q100.G R115.1 R190.1 R195.1 ; also sheet 3
IN_B4: Q99.G Q160.G Q163.G ; also sheet 2,3,13
IN_B4_N: Q101.G R114.1 R189.1 R194.1 ; also sheet 3
N$68: Q99.S Q100.D
N$70: Q101.S Q102.D
N$71: D67.K(C) R112.2
N$74: D69.K(C) R115.2
N$77: D68.K(C) R114.2
N$186: D112.K(C) R187.2
N$187: D114.K(C) R190.2
N$188: D113.K(C) R189.2
N$189: Q163.S Q164.D
N$190: D115.K(C) R192.2
N$193: D117.K(C) R195.2
N$194: D116.K(C) R194.2
OR4: Q162.D R188.1 ; also sheet 16
OR4_N: Q160.D Q161.D Q162.G R186.1 R187.1 ; also sheet 16
XOR4: Q103.D R113.1 ; also sheet 15
XOR4_N: Q99.D Q101.D Q103.G R111.1 R112.1 ; also sheet 15

### Notes on the sheet
- LED
  B
- LED
  A
- LED
  Y
- LED
  B
- LED
  A
- LED
  Y
- LED
  B
- LED
  A
- LED
  Y
- Y | Y | Y
- !Y | !Y | !Y
- B | B | B
- !B | !B | !B
- A | A | A
- !A | !A | !A
- XOR | AND | OR
- Gates for Bit 4

## Sheet 9 of 16
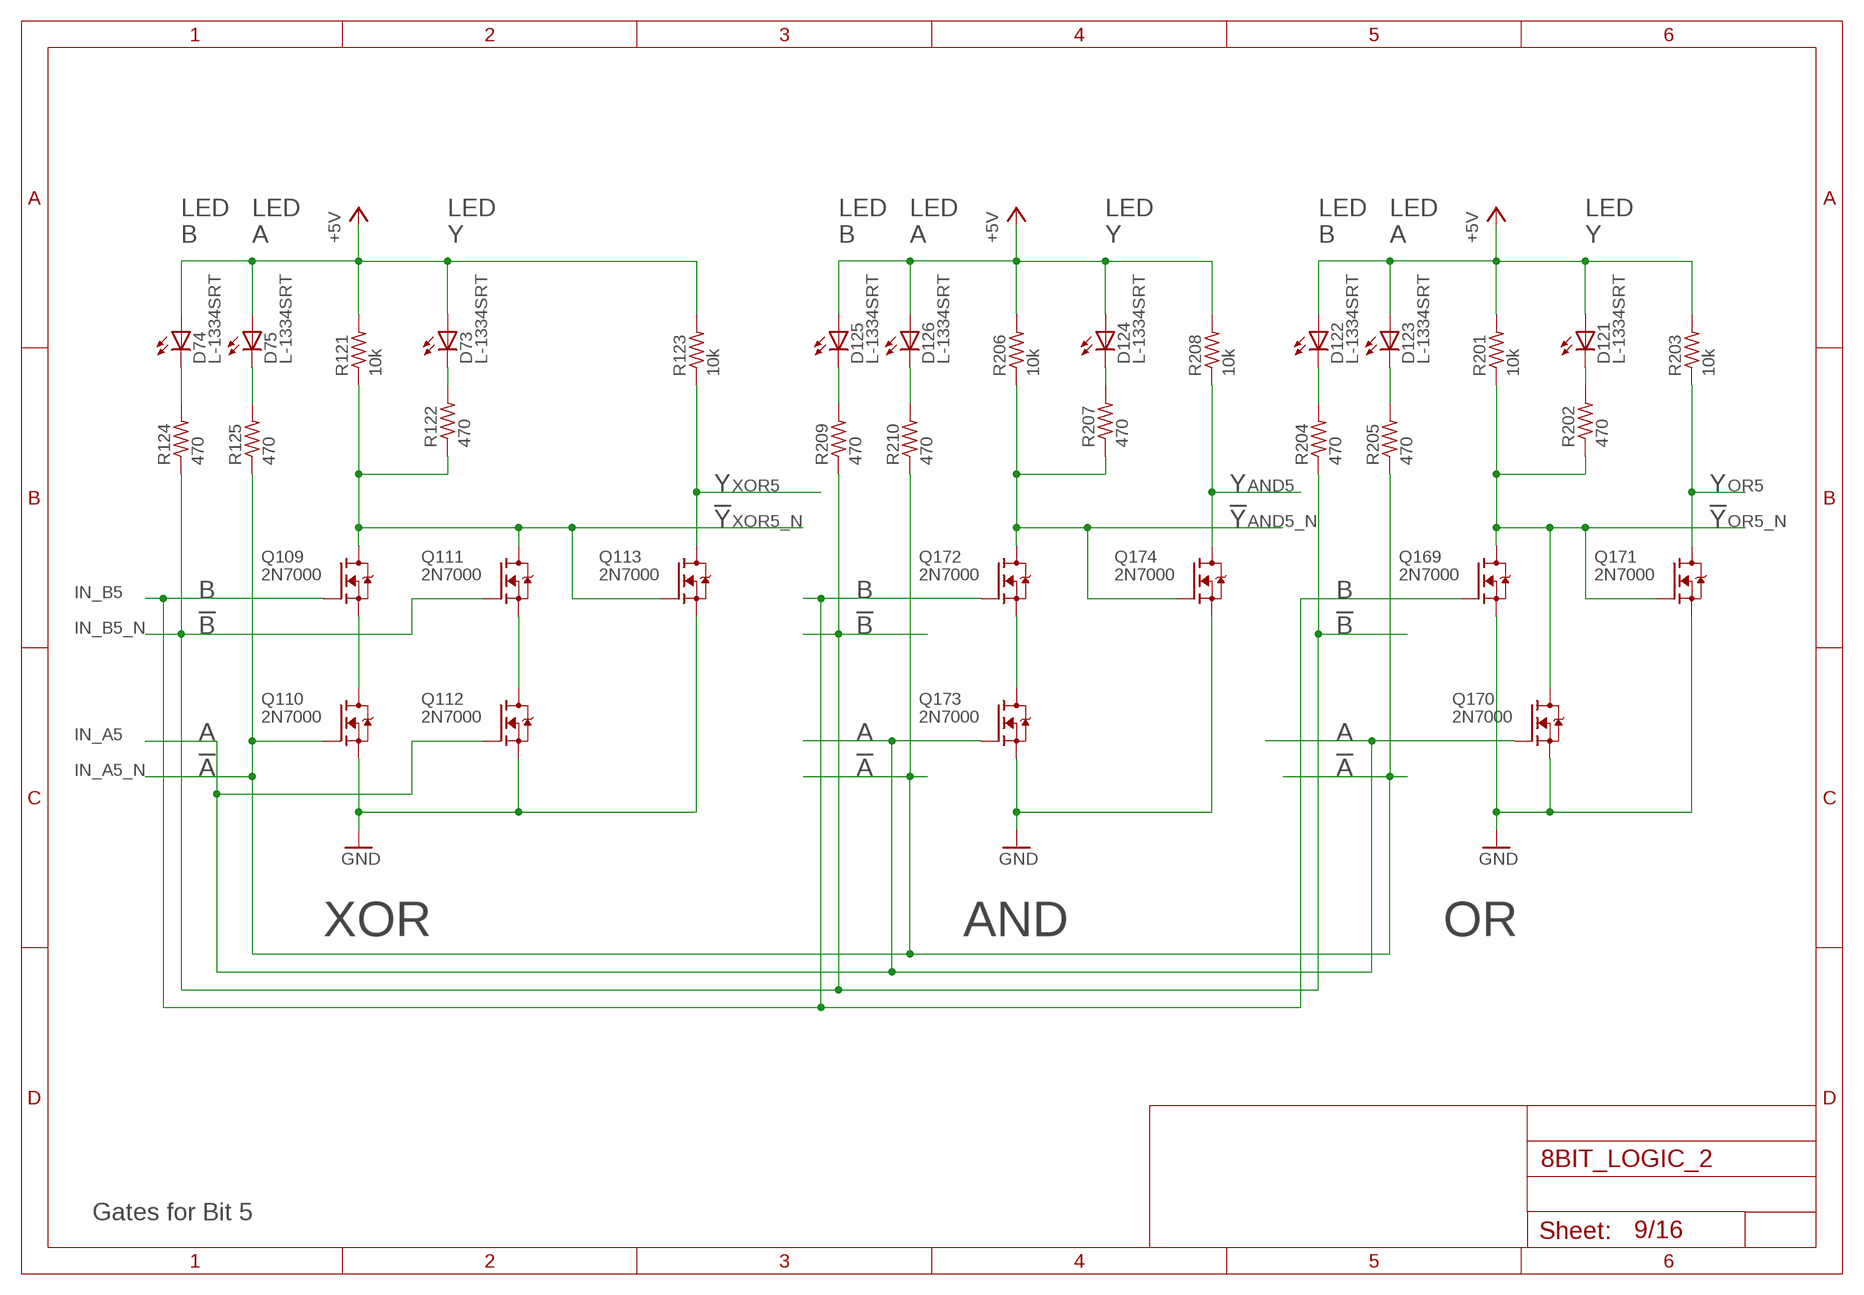
[diagram p8: schematic, sheet 9]

### Parts
D73  L-1334SRT  [LED3MM]
D74  L-1334SRT  [LED3MM]
D75  L-1334SRT  [LED3MM]
D121  L-1334SRT  [LED3MM]
D122  L-1334SRT  [LED3MM]
D123  L-1334SRT  [LED3MM]
D124  L-1334SRT  [LED3MM]
D125  L-1334SRT  [LED3MM]
D126  L-1334SRT  [LED3MM]
Q109  2N7000  [TO92-DGS]
Q110  2N7000  [TO92-DGS]
Q111  2N7000  [TO92-DGS]
Q112  2N7000  [TO92-DGS]
Q113  2N7000  [TO92-DGS]
Q169  2N7000  [TO92-DGS]
Q170  2N7000  [TO92-DGS]
Q171  2N7000  [TO92-DGS]
Q172  2N7000  [TO92-DGS]
Q173  2N7000  [TO92-DGS]
Q174  2N7000  [TO92-DGS]
R121  10k  R_P2INCH  [R_P2INCH]
R122  470  R_P2INCH  [R_P2INCH]
R123  10k  R_P2INCH  [R_P2INCH]
R124  470  R_P2INCH  [R_P2INCH]
R125  470  R_P2INCH  [R_P2INCH]
R201  10k  R_P2INCH  [R_P2INCH]
R202  470  R_P2INCH  [R_P2INCH]
R203  10k  R_P2INCH  [R_P2INCH]
R204  470  R_P2INCH  [R_P2INCH]
R205  470  R_P2INCH  [R_P2INCH]
R206  10k  R_P2INCH  [R_P2INCH]
R207  470  R_P2INCH  [R_P2INCH]
R208  10k  R_P2INCH  [R_P2INCH]
R209  470  R_P2INCH  [R_P2INCH]
R210  470  R_P2INCH  [R_P2INCH]

### Nets
+5V: D73.A D74.A D75.A D121.A D122.A D123.A D124.A D125.A D126.A R121.2 R123.2 R201.2 R203.2 R206.2 R208.2 ; also sheet 1,2,3,4,5,6,7,8,10,11,12,14,15,16
AND5: Q174.D R208.1 ; also sheet 14
AND5_N: Q172.D Q174.G R206.1 R207.1 ; also sheet 14
GND: Q110.S Q112.S Q113.S Q169.S Q170.S Q171.S Q173.S Q174.S ; also sheet 1,2,3,4,5,6,7,8,10,11,12,13,14,15,16
IN_A5: Q112.G Q170.G Q173.G ; also sheet 2,3,13
IN_A5_N: Q110.G R125.1 R205.1 R210.1 ; also sheet 3
IN_B5: Q109.G Q169.G Q172.G ; also sheet 2,3,13
IN_B5_N: Q111.G R124.1 R204.1 R209.1 ; also sheet 3
N$88: Q109.S Q110.D
N$89: Q111.S Q112.D
N$90: D73.K(C) R122.2
N$92: D75.K(C) R125.2
N$93: D74.K(C) R124.2
N$201: D121.K(C) R202.2
N$202: D123.K(C) R205.2
N$203: D122.K(C) R204.2
N$204: Q172.S Q173.D
N$205: D124.K(C) R207.2
N$208: D126.K(C) R210.2
N$209: D125.K(C) R209.2
OR5: Q171.D R203.1 ; also sheet 16
OR5_N: Q169.D Q170.D Q171.G R201.1 R202.1 ; also sheet 16
XOR5: Q113.D R123.1 ; also sheet 15
XOR5_N: Q109.D Q111.D Q113.G R121.1 R122.1 ; also sheet 15

### Notes on the sheet
- LED
  B
- LED
  A
- LED
  Y
- LED
  B
- LED
  A
- LED
  Y
- LED
  B
- LED
  A
- LED
  Y
- Y | Y | Y
- !Y | !Y | !Y
- B | B | B
- !B | !B | !B
- A | A | A
- !A | !A | !A
- XOR | AND | OR
- Gates for Bit 5

## Sheet 10 of 16
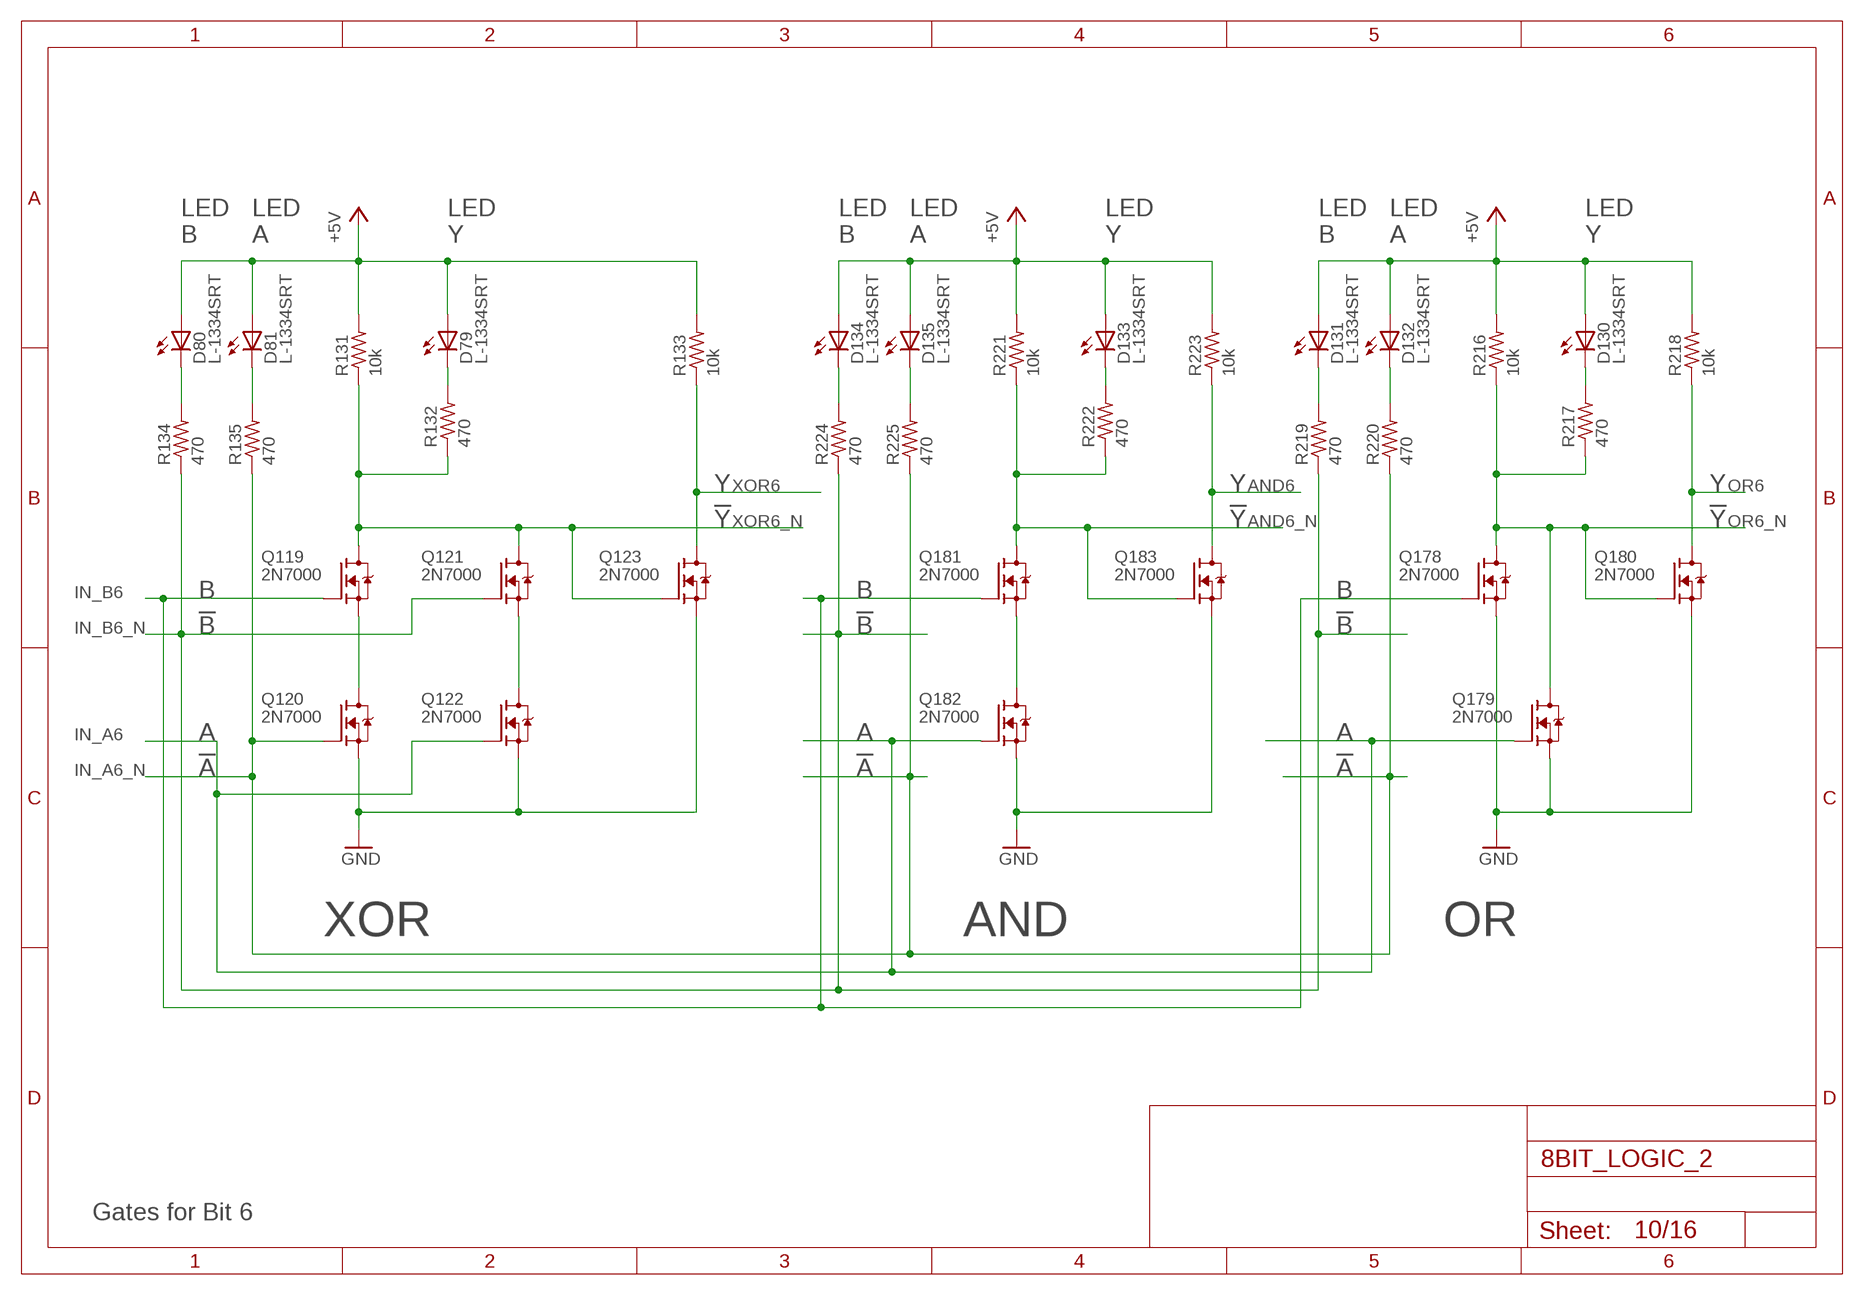
[diagram p9: schematic, sheet 10]

### Parts
D79  L-1334SRT  [LED3MM]
D80  L-1334SRT  [LED3MM]
D81  L-1334SRT  [LED3MM]
D130  L-1334SRT  [LED3MM]
D131  L-1334SRT  [LED3MM]
D132  L-1334SRT  [LED3MM]
D133  L-1334SRT  [LED3MM]
D134  L-1334SRT  [LED3MM]
D135  L-1334SRT  [LED3MM]
Q119  2N7000  [TO92-DGS]
Q120  2N7000  [TO92-DGS]
Q121  2N7000  [TO92-DGS]
Q122  2N7000  [TO92-DGS]
Q123  2N7000  [TO92-DGS]
Q178  2N7000  [TO92-DGS]
Q179  2N7000  [TO92-DGS]
Q180  2N7000  [TO92-DGS]
Q181  2N7000  [TO92-DGS]
Q182  2N7000  [TO92-DGS]
Q183  2N7000  [TO92-DGS]
R131  10k  R_P2INCH  [R_P2INCH]
R132  470  R_P2INCH  [R_P2INCH]
R133  10k  R_P2INCH  [R_P2INCH]
R134  470  R_P2INCH  [R_P2INCH]
R135  470  R_P2INCH  [R_P2INCH]
R216  10k  R_P2INCH  [R_P2INCH]
R217  470  R_P2INCH  [R_P2INCH]
R218  10k  R_P2INCH  [R_P2INCH]
R219  470  R_P2INCH  [R_P2INCH]
R220  470  R_P2INCH  [R_P2INCH]
R221  10k  R_P2INCH  [R_P2INCH]
R222  470  R_P2INCH  [R_P2INCH]
R223  10k  R_P2INCH  [R_P2INCH]
R224  470  R_P2INCH  [R_P2INCH]
R225  470  R_P2INCH  [R_P2INCH]

### Nets
+5V: D79.A D80.A D81.A D130.A D131.A D132.A D133.A D134.A D135.A R131.2 R133.2 R216.2 R218.2 R221.2 R223.2 ; also sheet 1,2,3,4,5,6,7,8,9,11,12,14,15,16
AND6: Q183.D R223.1 ; also sheet 14
AND6_N: Q181.D Q183.G R221.1 R222.1 ; also sheet 14
GND: Q120.S Q122.S Q123.S Q178.S Q179.S Q180.S Q182.S Q183.S ; also sheet 1,2,3,4,5,6,7,8,9,11,12,13,14,15,16
IN_A6: Q122.G Q179.G Q182.G ; also sheet 2,3,13
IN_A6_N: Q120.G R135.1 R220.1 R225.1 ; also sheet 3
IN_B6: Q119.G Q178.G Q181.G ; also sheet 2,3,13
IN_B6_N: Q121.G R134.1 R219.1 R224.1 ; also sheet 3
N$104: Q119.S Q120.D
N$107: Q121.S Q122.D
N$108: D79.K(C) R132.2
N$110: D81.K(C) R135.2
N$111: D80.K(C) R134.2
N$216: D130.K(C) R217.2
N$217: D132.K(C) R220.2
N$218: D131.K(C) R219.2
N$219: Q181.S Q182.D
N$220: D133.K(C) R222.2
N$223: D135.K(C) R225.2
N$224: D134.K(C) R224.2
OR6: Q180.D R218.1 ; also sheet 16
OR6_N: Q178.D Q179.D Q180.G R216.1 R217.1 ; also sheet 16
XOR6: Q123.D R133.1 ; also sheet 15
XOR6_N: Q119.D Q121.D Q123.G R131.1 R132.1 ; also sheet 15

### Notes on the sheet
- LED
  B
- LED
  A
- LED
  Y
- LED
  B
- LED
  A
- LED
  Y
- LED
  B
- LED
  A
- LED
  Y
- Y | Y | Y
- !Y | !Y | !Y
- B | B | B
- !B | !B | !B
- A | A | A
- !A | !A | !A
- XOR | AND | OR
- Gates for Bit 6

## Sheet 11 of 16
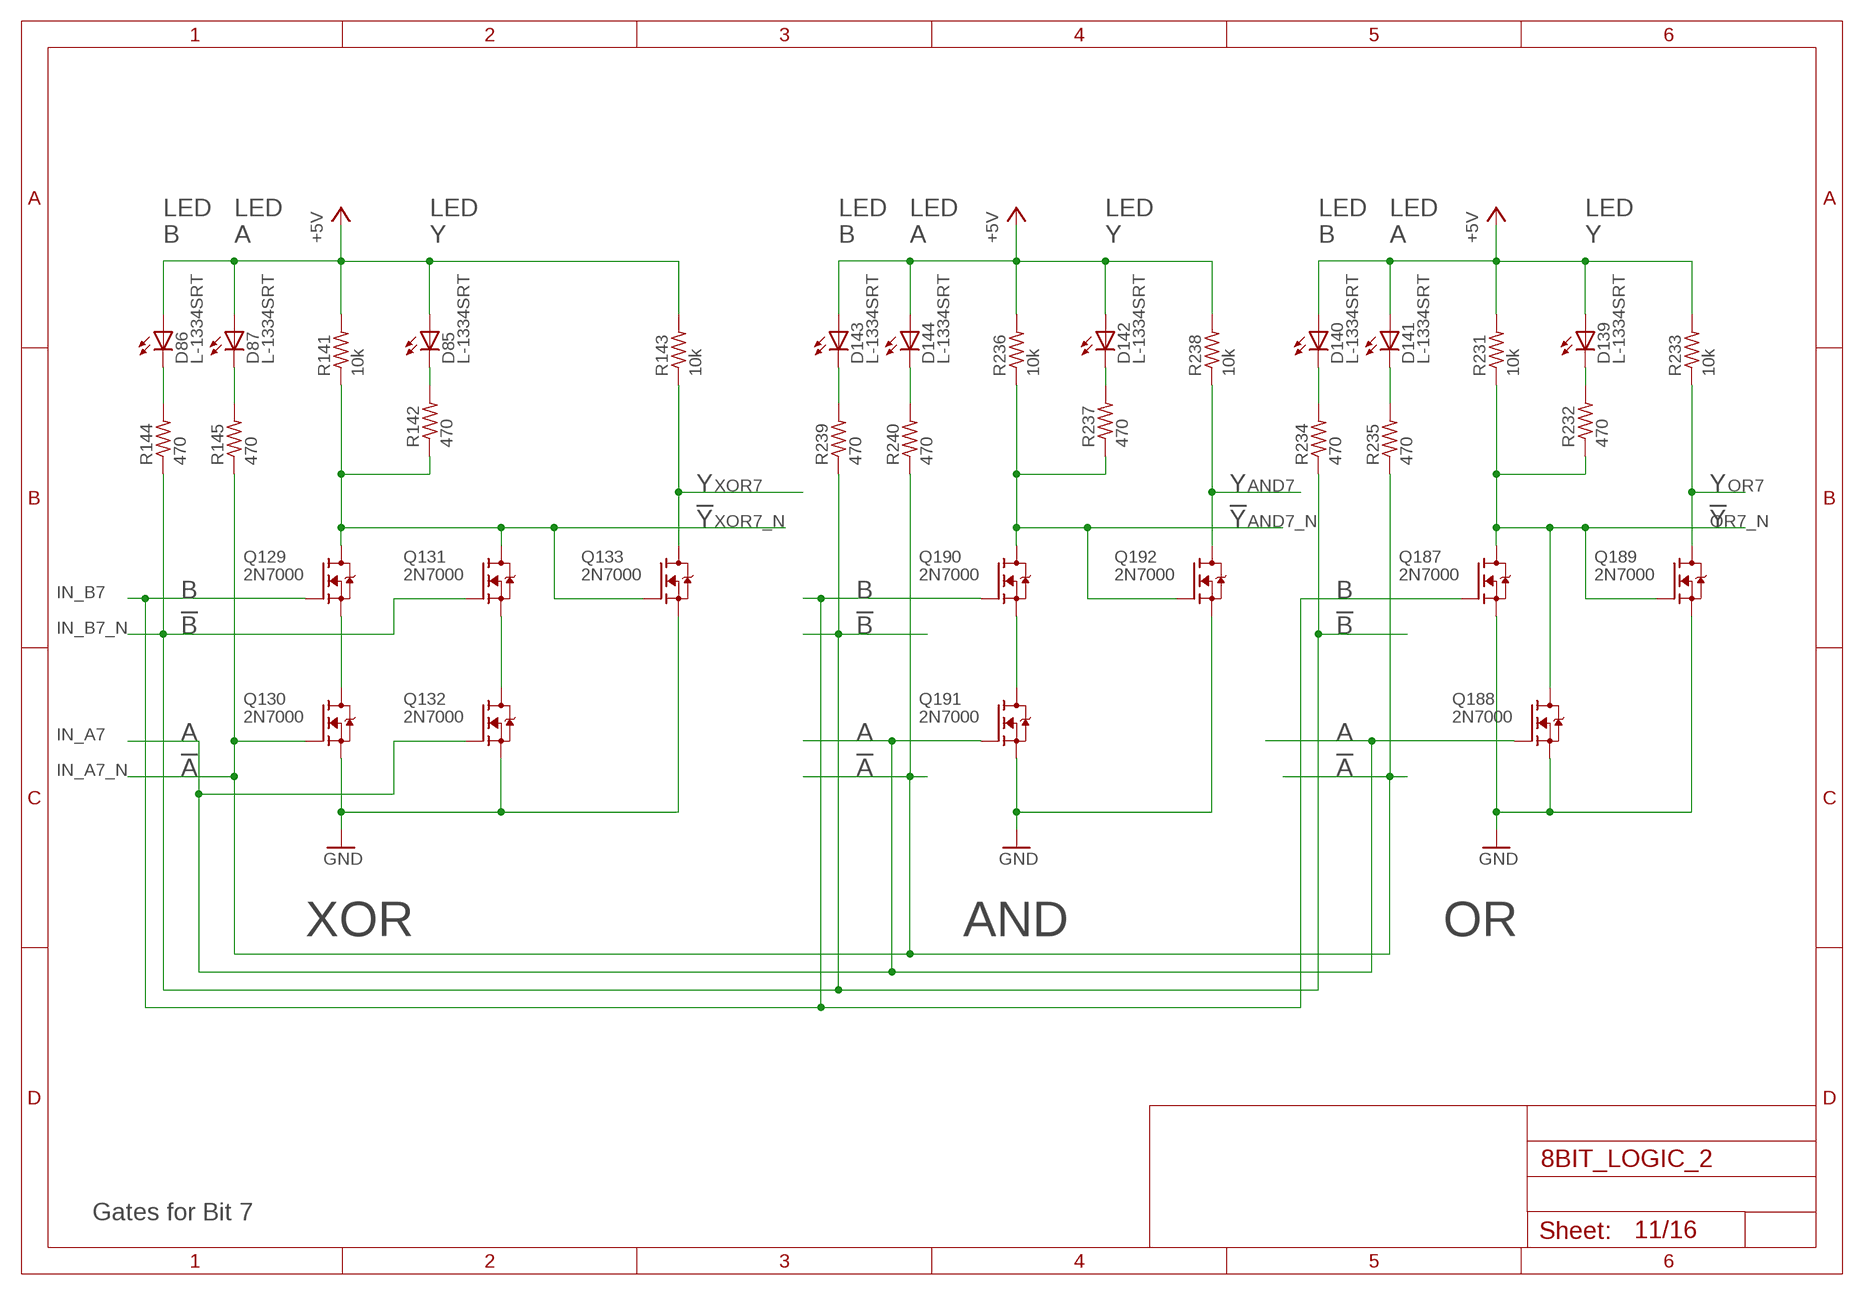
[diagram p10: schematic, sheet 11]

### Parts
D85  L-1334SRT  [LED3MM]
D86  L-1334SRT  [LED3MM]
D87  L-1334SRT  [LED3MM]
D139  L-1334SRT  [LED3MM]
D140  L-1334SRT  [LED3MM]
D141  L-1334SRT  [LED3MM]
D142  L-1334SRT  [LED3MM]
D143  L-1334SRT  [LED3MM]
D144  L-1334SRT  [LED3MM]
Q129  2N7000  [TO92-DGS]
Q130  2N7000  [TO92-DGS]
Q131  2N7000  [TO92-DGS]
Q132  2N7000  [TO92-DGS]
Q133  2N7000  [TO92-DGS]
Q187  2N7000  [TO92-DGS]
Q188  2N7000  [TO92-DGS]
Q189  2N7000  [TO92-DGS]
Q190  2N7000  [TO92-DGS]
Q191  2N7000  [TO92-DGS]
Q192  2N7000  [TO92-DGS]
R141  10k  R_P2INCH  [R_P2INCH]
R142  470  R_P2INCH  [R_P2INCH]
R143  10k  R_P2INCH  [R_P2INCH]
R144  470  R_P2INCH  [R_P2INCH]
R145  470  R_P2INCH  [R_P2INCH]
R231  10k  R_P2INCH  [R_P2INCH]
R232  470  R_P2INCH  [R_P2INCH]
R233  10k  R_P2INCH  [R_P2INCH]
R234  470  R_P2INCH  [R_P2INCH]
R235  470  R_P2INCH  [R_P2INCH]
R236  10k  R_P2INCH  [R_P2INCH]
R237  470  R_P2INCH  [R_P2INCH]
R238  10k  R_P2INCH  [R_P2INCH]
R239  470  R_P2INCH  [R_P2INCH]
R240  470  R_P2INCH  [R_P2INCH]

### Nets
+5V: D85.A D86.A D87.A D139.A D140.A D141.A D142.A D143.A D144.A R141.2 R143.2 R231.2 R233.2 R236.2 R238.2 ; also sheet 1,2,3,4,5,6,7,8,9,10,12,14,15,16
AND7: Q192.D R238.1 ; also sheet 14
AND7_N: Q190.D Q192.G R236.1 R237.1 ; also sheet 14
GND: Q130.S Q132.S Q133.S Q187.S Q188.S Q189.S Q191.S Q192.S ; also sheet 1,2,3,4,5,6,7,8,9,10,12,13,14,15,16
IN_A7: Q132.G Q188.G Q191.G ; also sheet 2,3,13
IN_A7_N: Q130.G R145.1 R235.1 R240.1 ; also sheet 3
IN_B7: Q129.G Q187.G Q190.G ; also sheet 2,3,13
IN_B7_N: Q131.G R144.1 R234.1 R239.1 ; also sheet 3
N$123: Q129.S Q130.D
N$126: Q131.S Q132.D
N$127: D85.K(C) R142.2
N$129: D87.K(C) R145.2
N$130: D86.K(C) R144.2
N$231: D139.K(C) R232.2
N$232: D141.K(C) R235.2
N$233: D140.K(C) R234.2
N$234: Q190.S Q191.D
N$235: D142.K(C) R237.2
N$238: D144.K(C) R240.2
N$239: D143.K(C) R239.2
OR7: Q189.D R233.1 ; also sheet 16
OR7_N: Q187.D Q188.D Q189.G R231.1 R232.1 ; also sheet 16
XOR7: Q133.D R143.1 ; also sheet 15
XOR7_N: Q129.D Q131.D Q133.G R141.1 R142.1 ; also sheet 15

### Notes on the sheet
- LED
  B
- LED
  A
- LED
  Y
- LED
  B
- LED
  A
- LED
  Y
- LED
  B
- LED
  A
- LED
  Y
- Y | Y | Y
- !Y | !Y | !Y
- B | B | B
- !B | !B | !B
- A | A | A
- !A | !A | !A
- XOR | AND | OR
- Gates for Bit 7

## Sheet 12 of 16
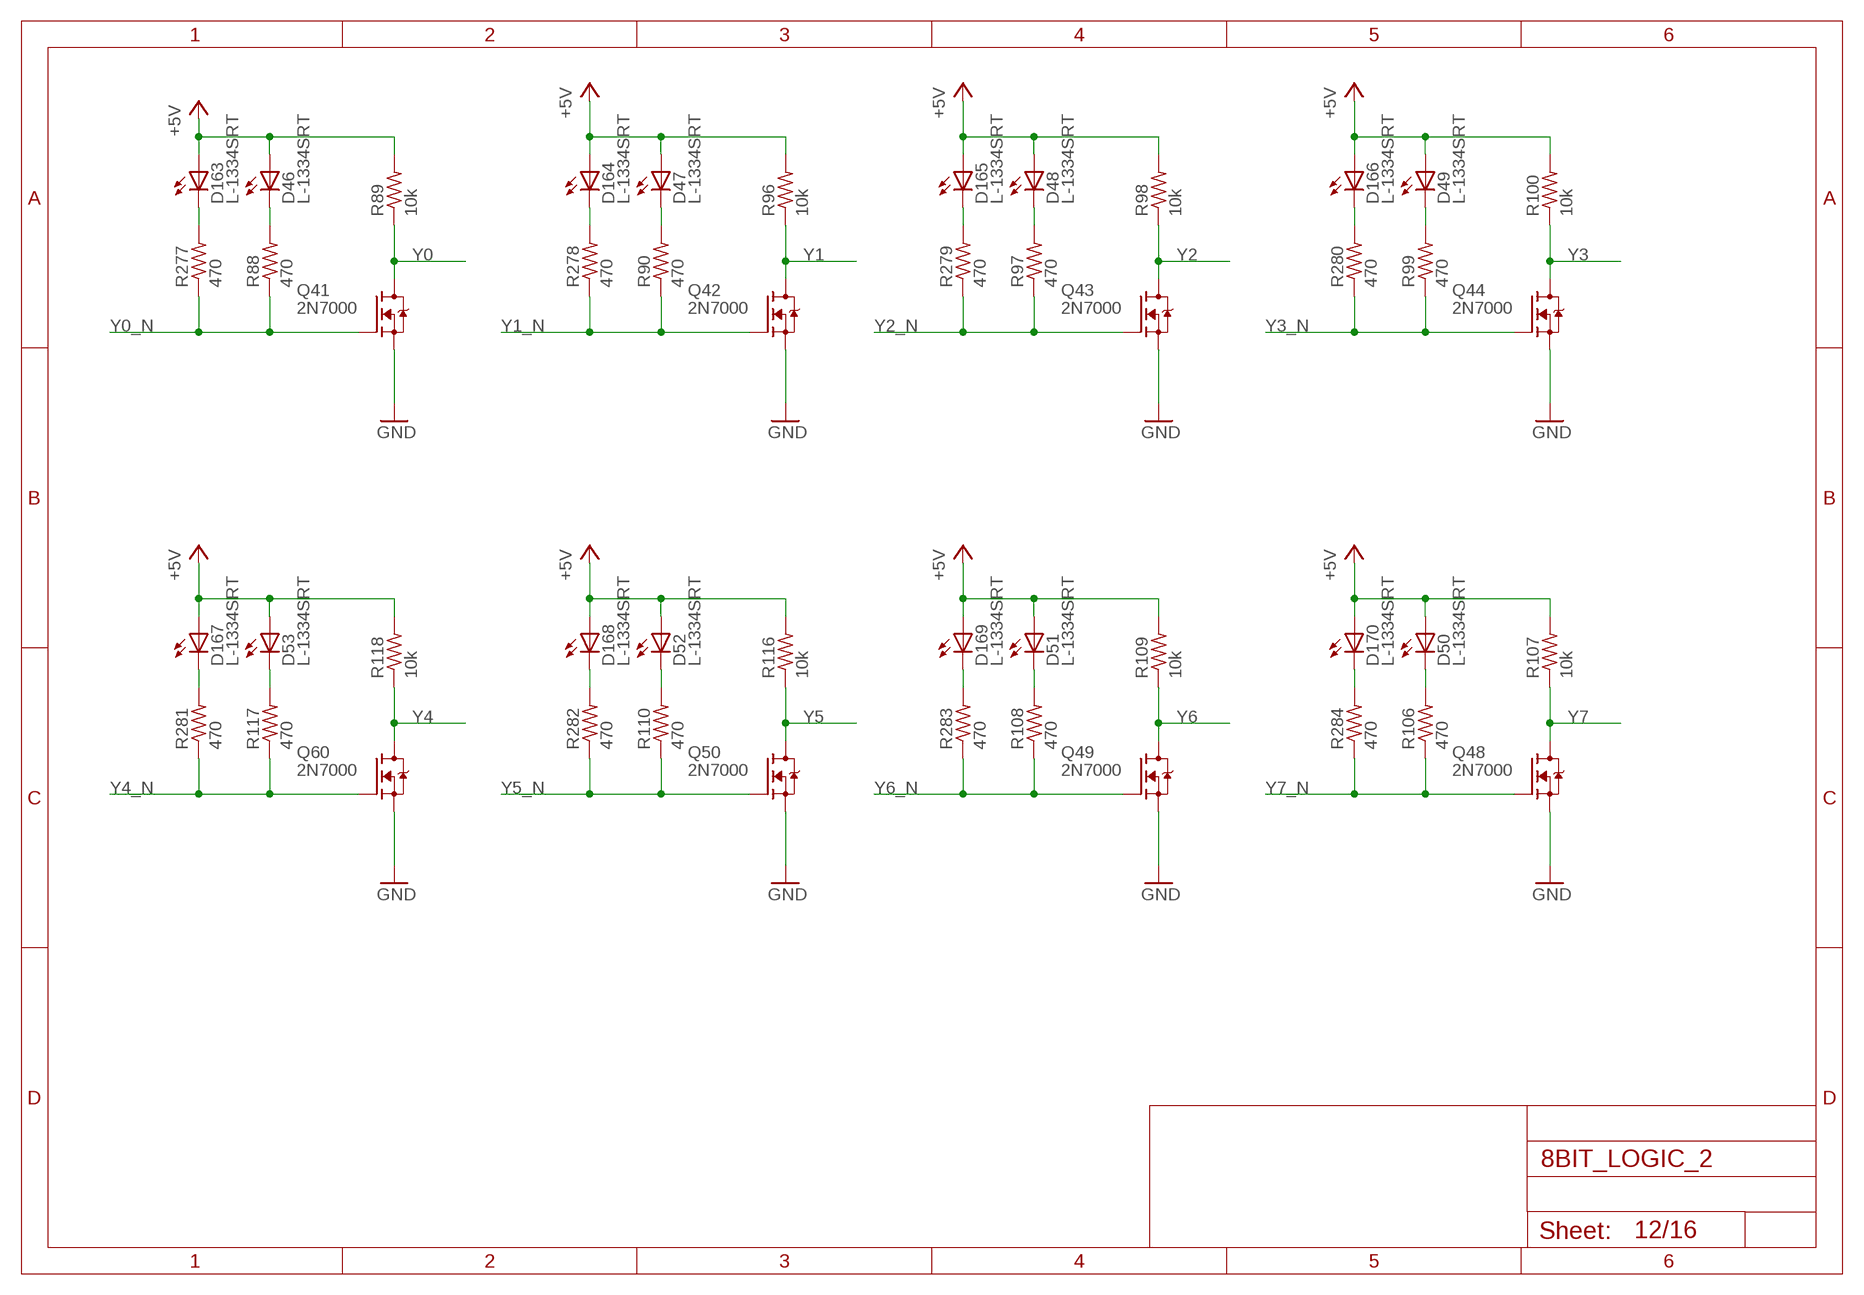
[diagram p11: schematic, sheet 12]

### Parts
D46  L-1334SRT  [LED3MM]
D47  L-1334SRT  [LED3MM]
D48  L-1334SRT  [LED3MM]
D49  L-1334SRT  [LED3MM]
D50  L-1334SRT  [LED3MM]
D51  L-1334SRT  [LED3MM]
D52  L-1334SRT  [LED3MM]
D53  L-1334SRT  [LED3MM]
D163  L-1334SRT  [LED3MM]
D164  L-1334SRT  [LED3MM]
D165  L-1334SRT  [LED3MM]
D166  L-1334SRT  [LED3MM]
D167  L-1334SRT  [LED3MM]
D168  L-1334SRT  [LED3MM]
D169  L-1334SRT  [LED3MM]
D170  L-1334SRT  [LED3MM]
Q41  2N7000  [TO92-DGS]
Q42  2N7000  [TO92-DGS]
Q43  2N7000  [TO92-DGS]
Q44  2N7000  [TO92-DGS]
Q48  2N7000  [TO92-DGS]
Q49  2N7000  [TO92-DGS]
Q50  2N7000  [TO92-DGS]
Q60  2N7000  [TO92-DGS]
R88  470  R_P2INCH  [R_P2INCH]
R89  10k  R_P2INCH  [R_P2INCH]
R90  470  R_P2INCH  [R_P2INCH]
R96  10k  R_P2INCH  [R_P2INCH]
R97  470  R_P2INCH  [R_P2INCH]
R98  10k  R_P2INCH  [R_P2INCH]
R99  470  R_P2INCH  [R_P2INCH]
R100  10k  R_P2INCH  [R_P2INCH]
R106  470  R_P2INCH  [R_P2INCH]
R107  10k  R_P2INCH  [R_P2INCH]
R108  470  R_P2INCH  [R_P2INCH]
R109  10k  R_P2INCH  [R_P2INCH]
R110  470  R_P2INCH  [R_P2INCH]
R116  10k  R_P2INCH  [R_P2INCH]
R117  470  R_P2INCH  [R_P2INCH]
R118  10k  R_P2INCH  [R_P2INCH]
R277  470  R_P2INCH  [R_P2INCH]
R278  470  R_P2INCH  [R_P2INCH]
R279  470  R_P2INCH  [R_P2INCH]
R280  470  R_P2INCH  [R_P2INCH]
R281  470  R_P2INCH  [R_P2INCH]
R282  470  R_P2INCH  [R_P2INCH]
R283  470  R_P2INCH  [R_P2INCH]
R284  470  R_P2INCH  [R_P2INCH]

### Nets
+5V: D46.A D47.A D48.A D49.A D50.A D51.A D52.A D53.A D163.A D164.A D165.A D166.A D167.A D168.A D169.A D170.A R89.2 R96.2 R98.2 R100.2 R107.2 R109.2 R116.2 R118.2 ; also sheet 1,2,3,4,5,6,7,8,9,10,11,14,15,16
GND: Q41.S Q42.S Q43.S Q44.S Q48.S Q49.S Q50.S Q60.S ; also sheet 1,2,3,4,5,6,7,8,9,10,11,13,14,15,16
N$20: D46.K(C) R88.2
N$25: D47.K(C) R90.2
N$30: D48.K(C) R97.2
N$44: D49.K(C) R99.2
N$47: D50.K(C) R106.2
N$51: D51.K(C) R108.2
N$79: D52.K(C) R110.2
N$85: D53.K(C) R117.2
N$258: D163.K(C) R277.2
N$260: D164.K(C) R278.2
N$261: D165.K(C) R279.2
N$262: D166.K(C) R280.2
N$263: D167.K(C) R281.2
N$264: D168.K(C) R282.2
N$265: D169.K(C) R283.2
N$266: D170.K(C) R284.2
Y0: Q41.D R89.1 ; also sheet 2,13
Y0_N: Q41.G R88.1 R277.1 ; also sheet 14,15,16
Y1: Q42.D R96.1 ; also sheet 2,13
Y1_N: Q42.G R90.1 R278.1 ; also sheet 14,15,16
Y2: Q43.D R98.1 ; also sheet 2,13
Y2_N: Q43.G R97.1 R279.1 ; also sheet 14,15,16
Y3: Q44.D R100.1 ; also sheet 2,13
Y3_N: Q44.G R99.1 R280.1 ; also sheet 14,15,16
Y4: Q60.D R118.1 ; also sheet 2,13
Y4_N: Q60.G R117.1 R281.1 ; also sheet 14,15,16
Y5: Q50.D R116.1 ; also sheet 2,13
Y5_N: Q50.G R110.1 R282.1 ; also sheet 14,15,16
Y6: Q49.D R109.1 ; also sheet 2,13
Y6_N: Q49.G R108.1 R283.1 ; also sheet 14,15,16
Y7: Q48.D R107.1 ; also sheet 2,13
Y7_N: Q48.G R106.1 R284.1 ; also sheet 14,15,16

## Sheet 13 of 16
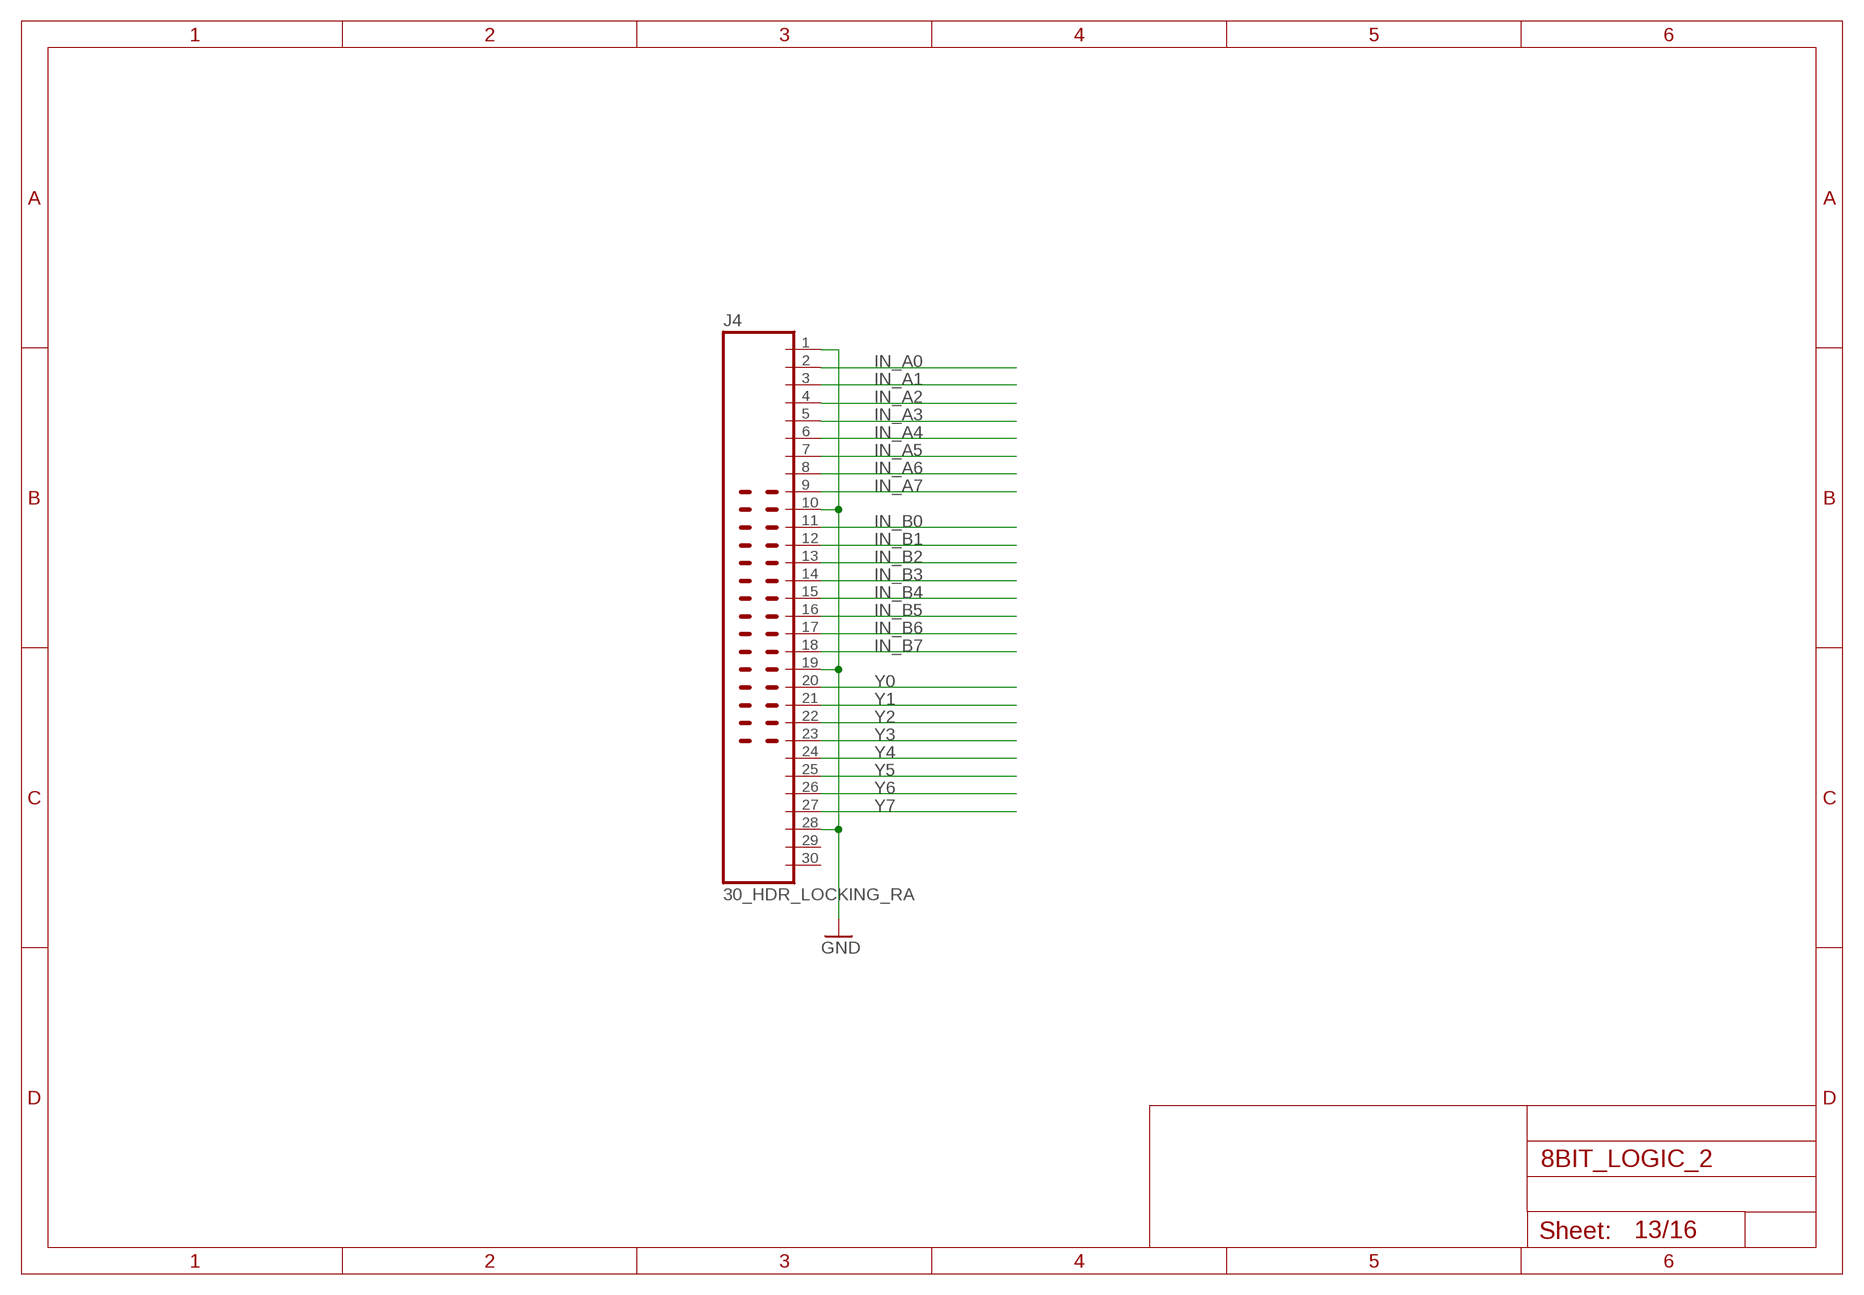
[diagram p12: schematic, sheet 13]

### Parts
J4  30_HDR_LOCKING_RA  [30_HDR_LOCKING_RA]

### Nets
GND: J4.1 J4.10 J4.19 J4.28 ; also sheet 1,2,3,4,5,6,7,8,9,10,11,12,14,15,16
IN_A0: J4.2 ; also sheet 2,3,4
IN_A1: J4.3 ; also sheet 2,3,5
IN_A2: J4.4 ; also sheet 2,3,6
IN_A3: J4.5 ; also sheet 2,3,7
IN_A4: J4.6 ; also sheet 2,3,8
IN_A5: J4.7 ; also sheet 2,3,9
IN_A6: J4.8 ; also sheet 2,3,10
IN_A7: J4.9 ; also sheet 2,3,11
IN_B0: J4.11 ; also sheet 2,3,4
IN_B1: J4.12 ; also sheet 2,3,5
IN_B2: J4.13 ; also sheet 2,3,6
IN_B3: J4.14 ; also sheet 2,3,7
IN_B4: J4.15 ; also sheet 2,3,8
IN_B5: J4.16 ; also sheet 2,3,9
IN_B6: J4.17 ; also sheet 2,3,10
IN_B7: J4.18 ; also sheet 2,3,11
Y0: J4.20 ; also sheet 2,12
Y1: J4.21 ; also sheet 2,12
Y2: J4.22 ; also sheet 2,12
Y3: J4.23 ; also sheet 2,12
Y4: J4.24 ; also sheet 2,12
Y5: J4.25 ; also sheet 2,12
Y6: J4.26 ; also sheet 2,12
Y7: J4.27 ; also sheet 2,12
Unconnected: J4.29 J4.30

## Sheet 14 of 16
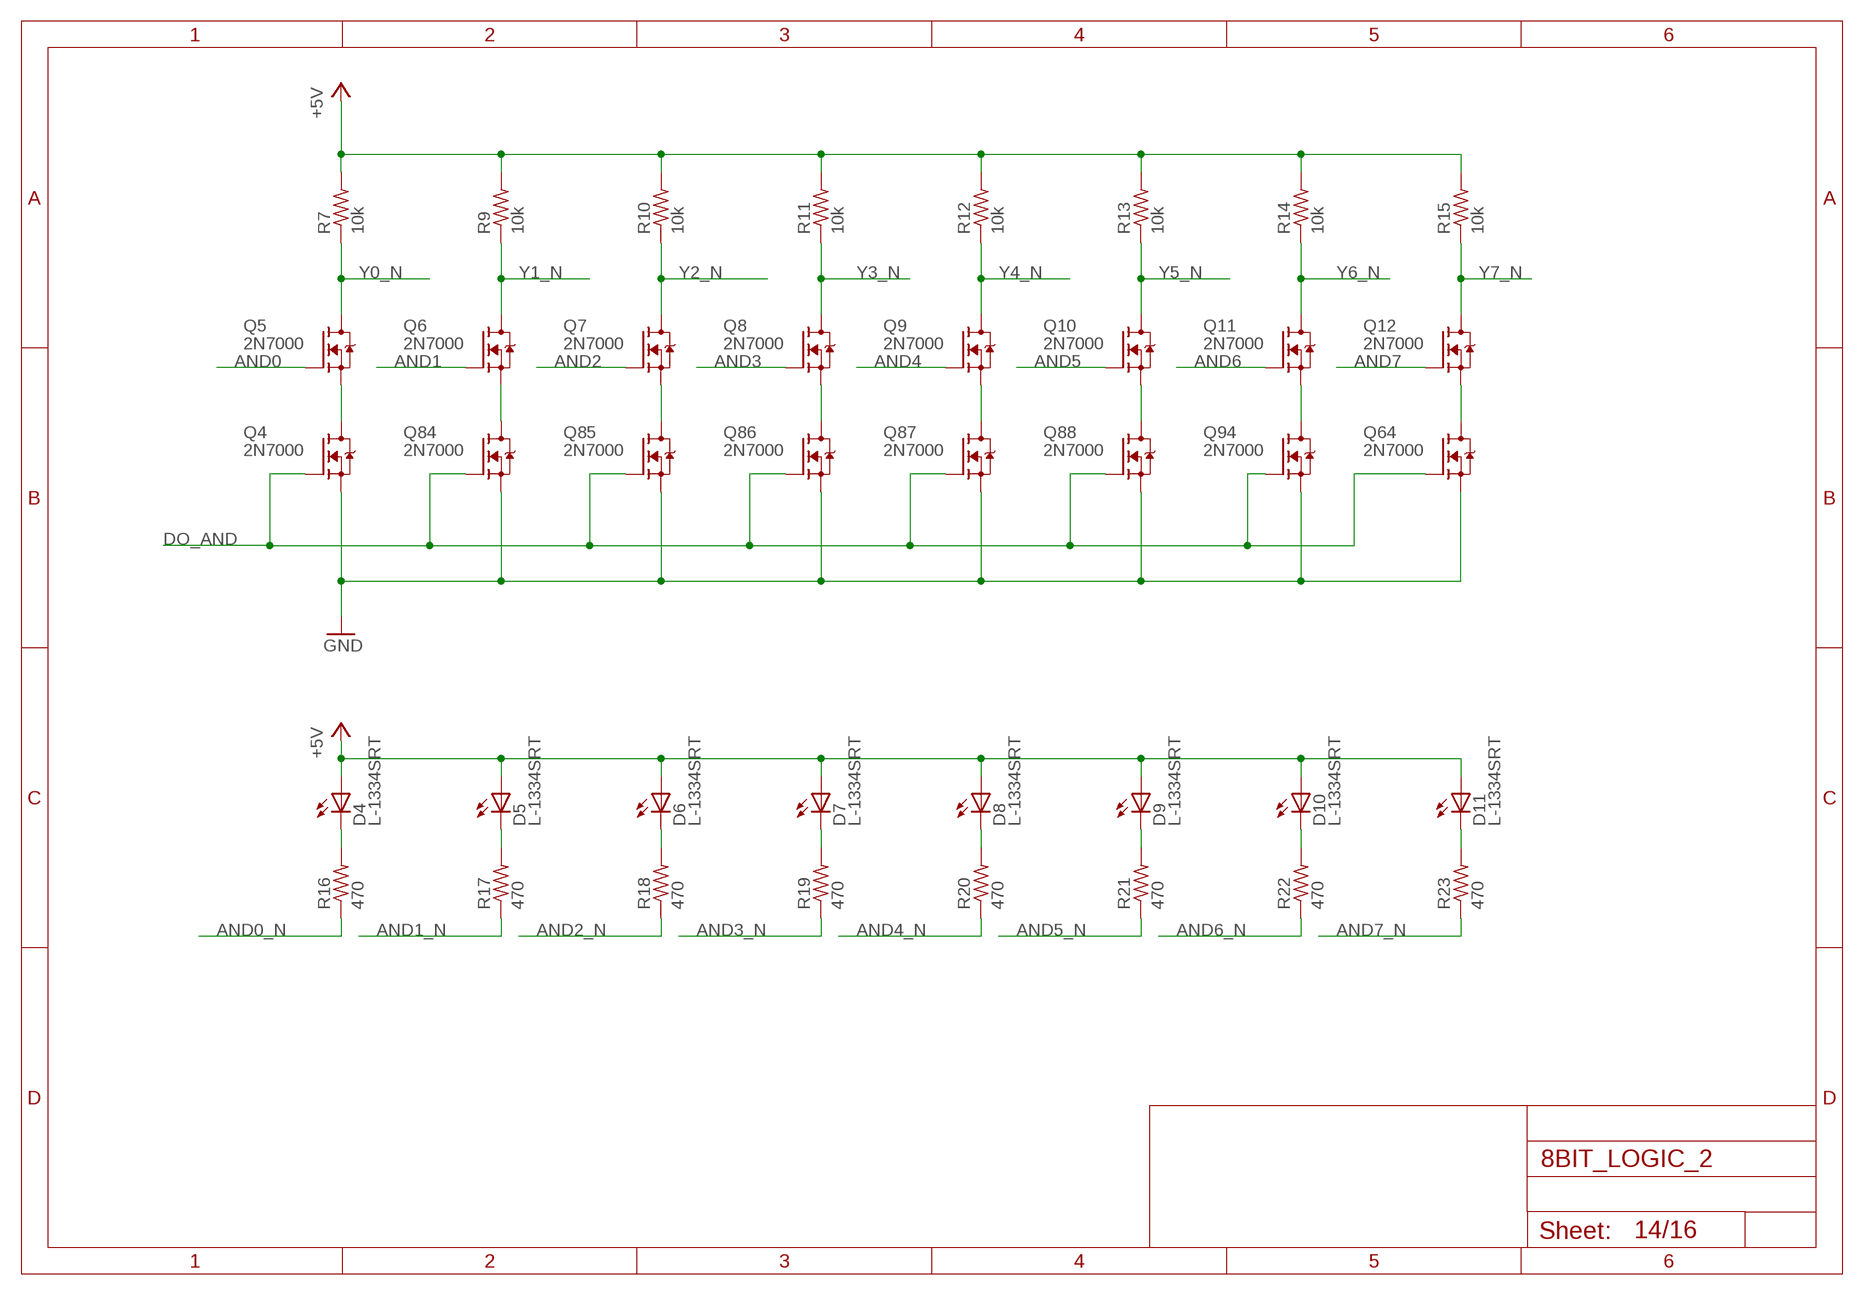
[diagram p13: schematic, sheet 14]

### Parts
D4  L-1334SRT  [LED3MM]
D5  L-1334SRT  [LED3MM]
D6  L-1334SRT  [LED3MM]
D7  L-1334SRT  [LED3MM]
D8  L-1334SRT  [LED3MM]
D9  L-1334SRT  [LED3MM]
D10  L-1334SRT  [LED3MM]
D11  L-1334SRT  [LED3MM]
Q4  2N7000  [TO92-DGS]
Q5  2N7000  [TO92-DGS]
Q6  2N7000  [TO92-DGS]
Q7  2N7000  [TO92-DGS]
Q8  2N7000  [TO92-DGS]
Q9  2N7000  [TO92-DGS]
Q10  2N7000  [TO92-DGS]
Q11  2N7000  [TO92-DGS]
Q12  2N7000  [TO92-DGS]
Q64  2N7000  [TO92-DGS]
Q84  2N7000  [TO92-DGS]
Q85  2N7000  [TO92-DGS]
Q86  2N7000  [TO92-DGS]
Q87  2N7000  [TO92-DGS]
Q88  2N7000  [TO92-DGS]
Q94  2N7000  [TO92-DGS]
R7  10k  R_P2INCH  [R_P2INCH]
R9  10k  R_P2INCH  [R_P2INCH]
R10  10k  R_P2INCH  [R_P2INCH]
R11  10k  R_P2INCH  [R_P2INCH]
R12  10k  R_P2INCH  [R_P2INCH]
R13  10k  R_P2INCH  [R_P2INCH]
R14  10k  R_P2INCH  [R_P2INCH]
R15  10k  R_P2INCH  [R_P2INCH]
R16  470  R_P2INCH  [R_P2INCH]
R17  470  R_P2INCH  [R_P2INCH]
R18  470  R_P2INCH  [R_P2INCH]
R19  470  R_P2INCH  [R_P2INCH]
R20  470  R_P2INCH  [R_P2INCH]
R21  470  R_P2INCH  [R_P2INCH]
R22  470  R_P2INCH  [R_P2INCH]
R23  470  R_P2INCH  [R_P2INCH]

### Nets
+5V: D4.A D5.A D6.A D7.A D8.A D9.A D10.A D11.A R7.2 R9.2 R10.2 R11.2 R12.2 R13.2 R14.2 R15.2 ; also sheet 1,2,3,4,5,6,7,8,9,10,11,12,15,16
AND0: Q5.G ; also sheet 4
AND0_N: R16.1 ; also sheet 4
AND1: Q6.G ; also sheet 5
AND1_N: R17.1 ; also sheet 5
AND2: Q7.G ; also sheet 6
AND2_N: R18.1 ; also sheet 6
AND3: Q8.G ; also sheet 7
AND3_N: R19.1 ; also sheet 7
AND4: Q9.G ; also sheet 8
AND4_N: R20.1 ; also sheet 8
AND5: Q10.G ; also sheet 9
AND5_N: R21.1 ; also sheet 9
AND6: Q11.G ; also sheet 10
AND6_N: R22.1 ; also sheet 10
AND7: Q12.G ; also sheet 11
AND7_N: R23.1 ; also sheet 11
DO_AND: Q4.G Q64.G Q84.G Q85.G Q86.G Q87.G Q88.G Q94.G ; also sheet 2
GND: Q4.S Q64.S Q84.S Q85.S Q86.S Q87.S Q88.S Q94.S ; also sheet 1,2,3,4,5,6,7,8,9,10,11,12,13,15,16
N$4: Q12.S Q64.D
N$8: Q4.D Q5.S
N$9: Q6.S Q84.D
N$10: Q7.S Q85.D
N$11: Q8.S Q86.D
N$12: Q9.S Q87.D
N$14: Q10.S Q88.D
N$21: Q11.S Q94.D
N$23: D4.K(C) R16.2
N$27: D5.K(C) R17.2
N$29: D6.K(C) R18.2
N$31: D7.K(C) R19.2
N$36: D8.K(C) R20.2
N$40: D9.K(C) R21.2
N$41: D10.K(C) R22.2
N$42: D11.K(C) R23.2
Y0_N: Q5.D R7.1 ; also sheet 12,15,16
Y1_N: Q6.D R9.1 ; also sheet 12,15,16
Y2_N: Q7.D R10.1 ; also sheet 12,15,16
Y3_N: Q8.D R11.1 ; also sheet 12,15,16
Y4_N: Q9.D R12.1 ; also sheet 12,15,16
Y5_N: Q10.D R13.1 ; also sheet 12,15,16
Y6_N: Q11.D R14.1 ; also sheet 12,15,16
Y7_N: Q12.D R15.1 ; also sheet 12,15,16

## Sheet 15 of 16
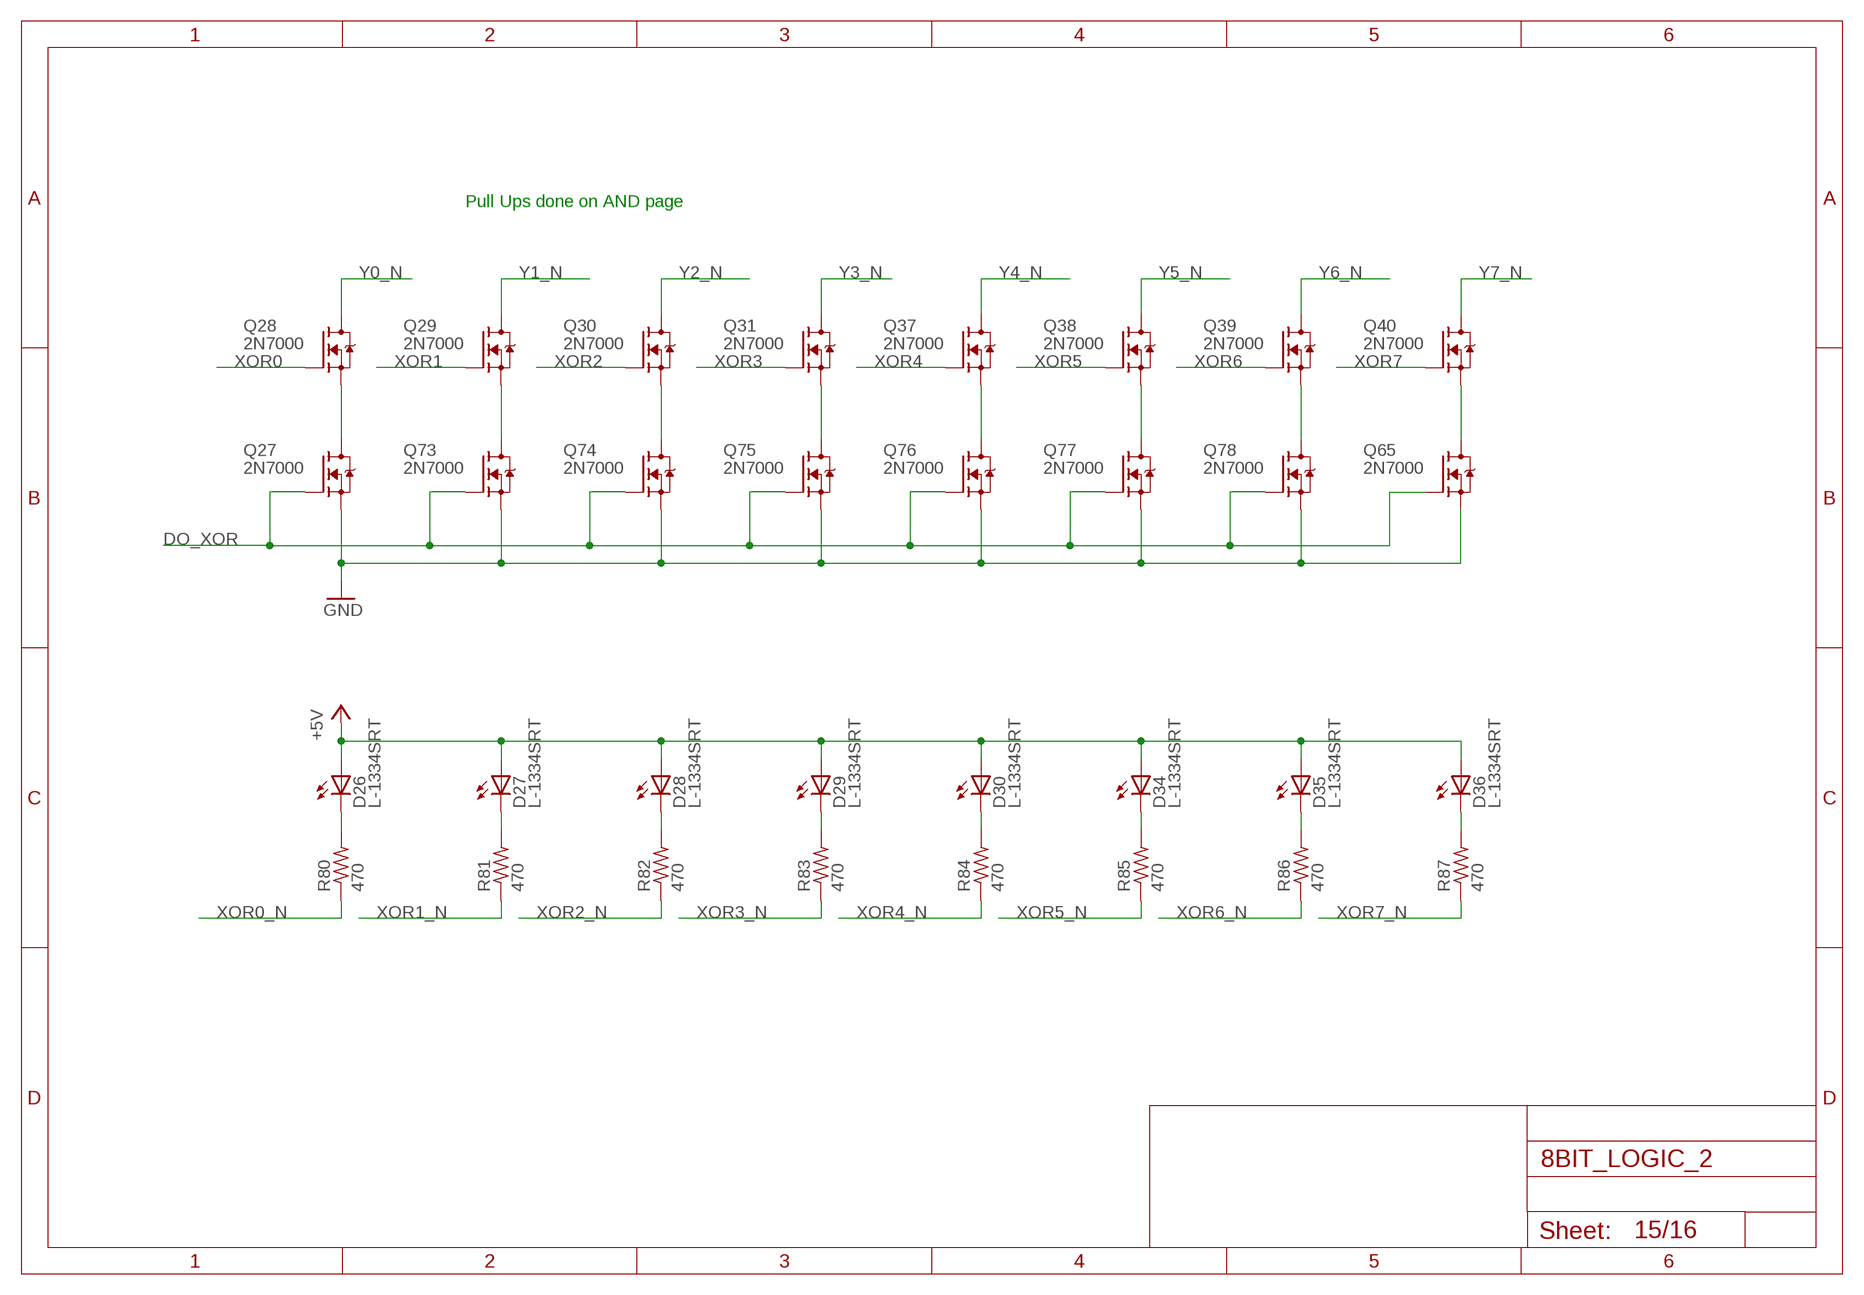
[diagram p14: schematic, sheet 15]

### Parts
D26  L-1334SRT  [LED3MM]
D27  L-1334SRT  [LED3MM]
D28  L-1334SRT  [LED3MM]
D29  L-1334SRT  [LED3MM]
D30  L-1334SRT  [LED3MM]
D34  L-1334SRT  [LED3MM]
D35  L-1334SRT  [LED3MM]
D36  L-1334SRT  [LED3MM]
Q27  2N7000  [TO92-DGS]
Q28  2N7000  [TO92-DGS]
Q29  2N7000  [TO92-DGS]
Q30  2N7000  [TO92-DGS]
Q31  2N7000  [TO92-DGS]
Q37  2N7000  [TO92-DGS]
Q38  2N7000  [TO92-DGS]
Q39  2N7000  [TO92-DGS]
Q40  2N7000  [TO92-DGS]
Q65  2N7000  [TO92-DGS]
Q73  2N7000  [TO92-DGS]
Q74  2N7000  [TO92-DGS]
Q75  2N7000  [TO92-DGS]
Q76  2N7000  [TO92-DGS]
Q77  2N7000  [TO92-DGS]
Q78  2N7000  [TO92-DGS]
R80  470  R_P2INCH  [R_P2INCH]
R81  470  R_P2INCH  [R_P2INCH]
R82  470  R_P2INCH  [R_P2INCH]
R83  470  R_P2INCH  [R_P2INCH]
R84  470  R_P2INCH  [R_P2INCH]
R85  470  R_P2INCH  [R_P2INCH]
R86  470  R_P2INCH  [R_P2INCH]
R87  470  R_P2INCH  [R_P2INCH]

### Nets
+5V: D26.A D27.A D28.A D29.A D30.A D34.A D35.A D36.A ; also sheet 1,2,3,4,5,6,7,8,9,10,11,12,14,16
DO_XOR: Q27.G Q65.G Q73.G Q74.G Q75.G Q76.G Q77.G Q78.G ; also sheet 2
GND: Q27.S Q65.S Q73.S Q74.S Q75.S Q76.S Q77.S Q78.S ; also sheet 1,2,3,4,5,6,7,8,9,10,11,12,13,14,16
N$15: Q27.D Q28.S
N$16: Q29.S Q73.D
N$17: Q30.S Q74.D
N$18: Q31.S Q75.D
N$19: Q37.S Q76.D
N$22: Q38.S Q77.D
N$24: Q39.S Q78.D
N$73: Q40.S Q65.D
N$91: D26.K(C) R80.2
N$94: D27.K(C) R81.2
N$95: D28.K(C) R82.2
N$96: D29.K(C) R83.2
N$97: D30.K(C) R84.2
N$98: D34.K(C) R85.2
N$99: D35.K(C) R86.2
N$100: D36.K(C) R87.2
XOR0: Q28.G ; also sheet 4
XOR0_N: R80.1 ; also sheet 4
XOR1: Q29.G ; also sheet 5
XOR1_N: R81.1 ; also sheet 5
XOR2: Q30.G ; also sheet 6
XOR2_N: R82.1 ; also sheet 6
XOR3: Q31.G ; also sheet 7
XOR3_N: R83.1 ; also sheet 7
XOR4: Q37.G ; also sheet 8
XOR4_N: R84.1 ; also sheet 8
XOR5: Q38.G ; also sheet 9
XOR5_N: R85.1 ; also sheet 9
XOR6: Q39.G ; also sheet 10
XOR6_N: R86.1 ; also sheet 10
XOR7: Q40.G ; also sheet 11
XOR7_N: R87.1 ; also sheet 11
Y0_N: Q28.D ; also sheet 12,14,16
Y1_N: Q29.D ; also sheet 12,14,16
Y2_N: Q30.D ; also sheet 12,14,16
Y3_N: Q31.D ; also sheet 12,14,16
Y4_N: Q37.D ; also sheet 12,14,16
Y5_N: Q38.D ; also sheet 12,14,16
Y6_N: Q39.D ; also sheet 12,14,16
Y7_N: Q40.D ; also sheet 12,14,16

### Notes on the sheet
- Pull Ups done on AND page

## Sheet 16 of 16
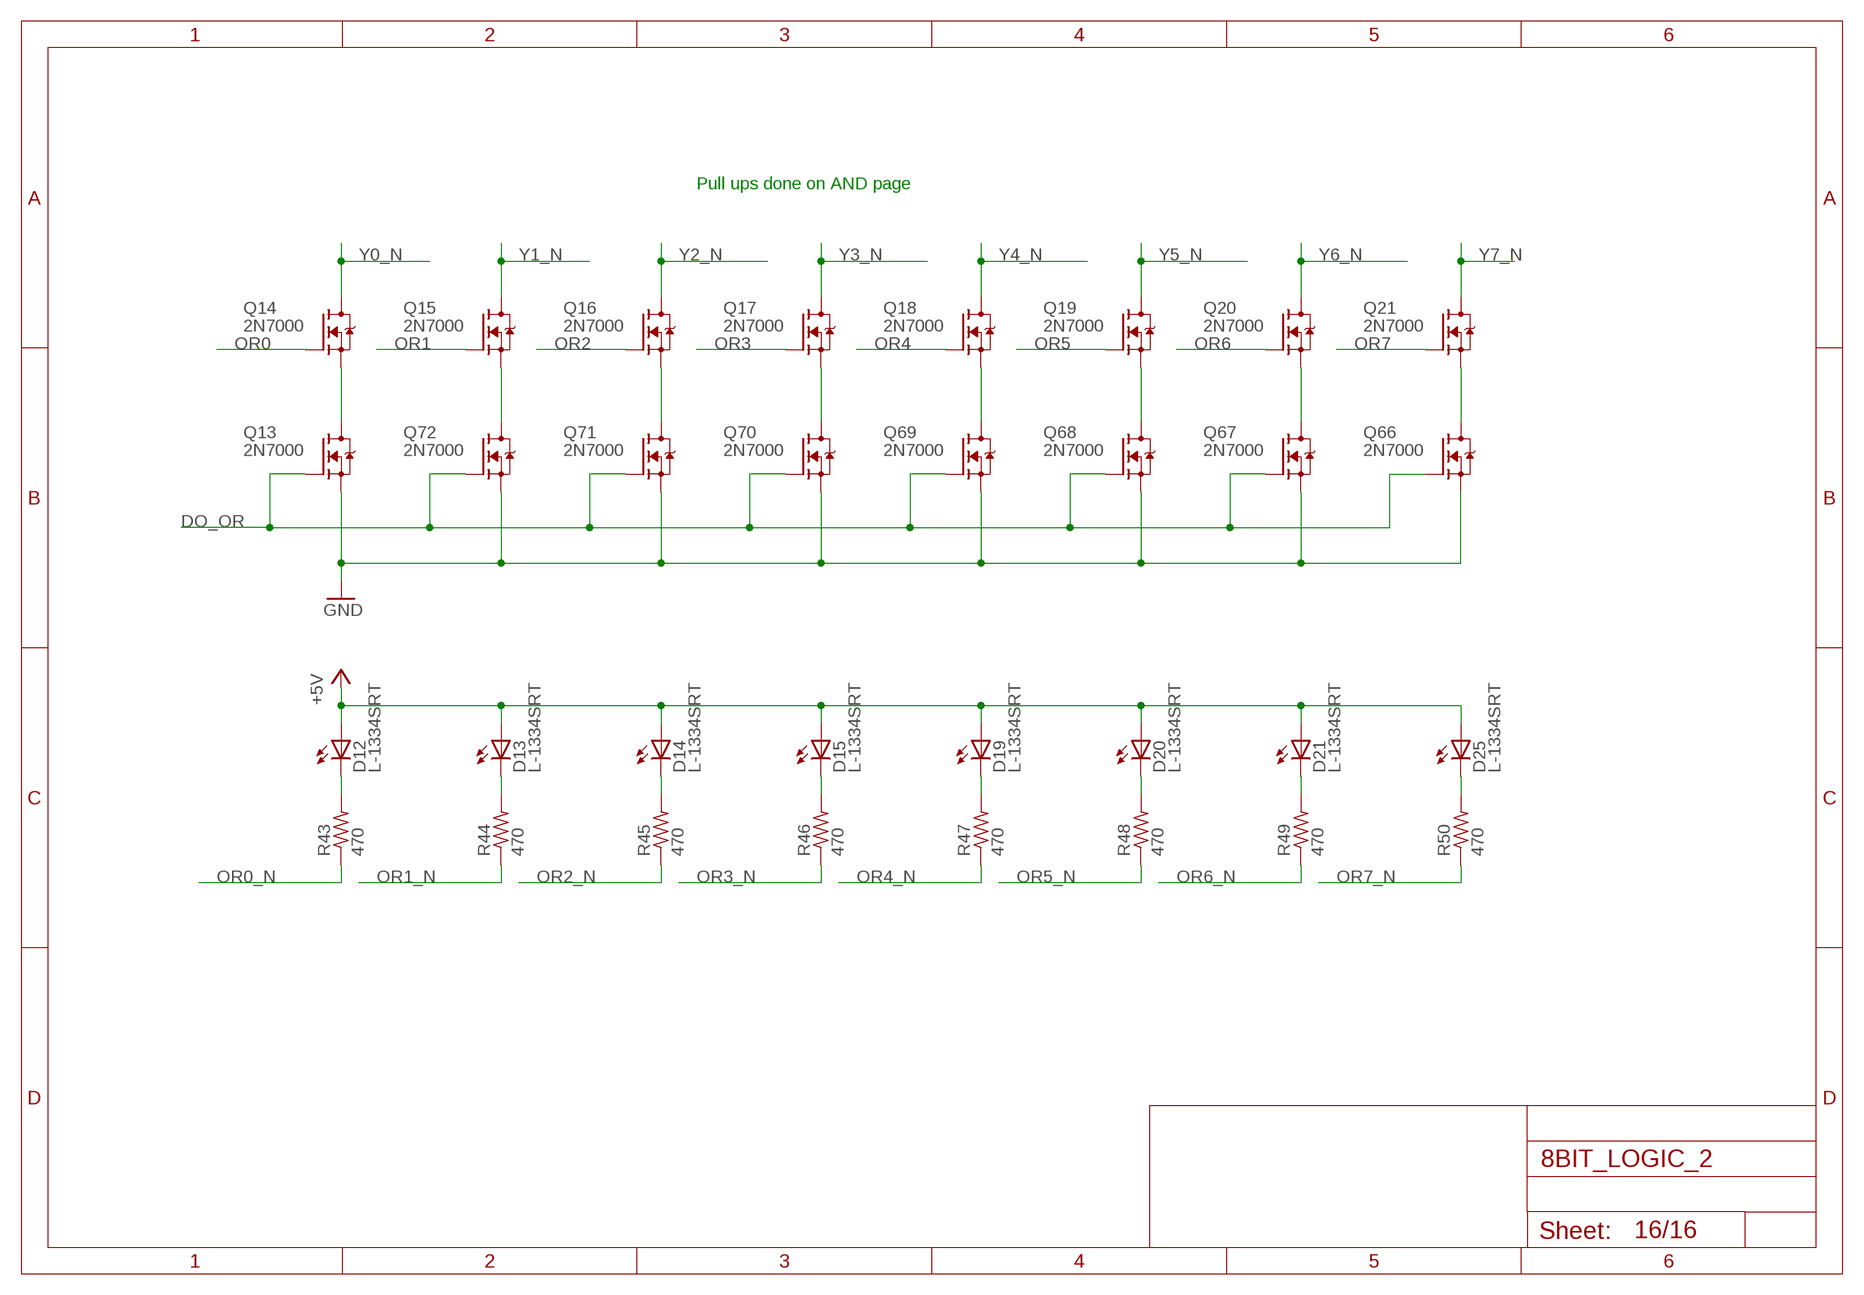
[diagram p15: schematic, sheet 16]

### Parts
D12  L-1334SRT  [LED3MM]
D13  L-1334SRT  [LED3MM]
D14  L-1334SRT  [LED3MM]
D15  L-1334SRT  [LED3MM]
D19  L-1334SRT  [LED3MM]
D20  L-1334SRT  [LED3MM]
D21  L-1334SRT  [LED3MM]
D25  L-1334SRT  [LED3MM]
Q13  2N7000  [TO92-DGS]
Q14  2N7000  [TO92-DGS]
Q15  2N7000  [TO92-DGS]
Q16  2N7000  [TO92-DGS]
Q17  2N7000  [TO92-DGS]
Q18  2N7000  [TO92-DGS]
Q19  2N7000  [TO92-DGS]
Q20  2N7000  [TO92-DGS]
Q21  2N7000  [TO92-DGS]
Q66  2N7000  [TO92-DGS]
Q67  2N7000  [TO92-DGS]
Q68  2N7000  [TO92-DGS]
Q69  2N7000  [TO92-DGS]
Q70  2N7000  [TO92-DGS]
Q71  2N7000  [TO92-DGS]
Q72  2N7000  [TO92-DGS]
R43  470  R_P2INCH  [R_P2INCH]
R44  470  R_P2INCH  [R_P2INCH]
R45  470  R_P2INCH  [R_P2INCH]
R46  470  R_P2INCH  [R_P2INCH]
R47  470  R_P2INCH  [R_P2INCH]
R48  470  R_P2INCH  [R_P2INCH]
R49  470  R_P2INCH  [R_P2INCH]
R50  470  R_P2INCH  [R_P2INCH]

### Nets
+5V: D12.A D13.A D14.A D15.A D19.A D20.A D21.A D25.A ; also sheet 1,2,3,4,5,6,7,8,9,10,11,12,14,15
DO_OR: Q13.G Q66.G Q67.G Q68.G Q69.G Q70.G Q71.G Q72.G ; also sheet 2
GND: Q13.S Q66.S Q67.S Q68.S Q69.S Q70.S Q71.S Q72.S ; also sheet 1,2,3,4,5,6,7,8,9,10,11,12,13,14,15
N$26: Q13.D Q14.S
N$28: Q15.S Q72.D
N$32: Q16.S Q71.D
N$39: Q17.S Q70.D
N$43: Q18.S Q69.D
N$45: Q19.S Q68.D
N$46: Q20.S Q67.D
N$48: Q21.S Q66.D
N$59: D12.K(C) R43.2
N$60: D13.K(C) R44.2
N$63: D14.K(C) R45.2
N$64: D15.K(C) R46.2
N$65: D19.K(C) R47.2
N$66: D20.K(C) R48.2
N$67: D21.K(C) R49.2
N$69: D25.K(C) R50.2
OR0: Q14.G ; also sheet 4
OR0_N: R43.1 ; also sheet 4
OR1: Q15.G ; also sheet 5
OR1_N: R44.1 ; also sheet 5
OR2: Q16.G ; also sheet 6
OR2_N: R45.1 ; also sheet 6
OR3: Q17.G ; also sheet 7
OR3_N: R46.1 ; also sheet 7
OR4: Q18.G ; also sheet 8
OR4_N: R47.1 ; also sheet 8
OR5: Q19.G ; also sheet 9
OR5_N: R48.1 ; also sheet 9
OR6: Q20.G ; also sheet 10
OR6_N: R49.1 ; also sheet 10
OR7: Q21.G ; also sheet 11
OR7_N: R50.1 ; also sheet 11
Y0_N: Q14.D ; also sheet 12,14,15
Y1_N: Q15.D ; also sheet 12,14,15
Y2_N: Q16.D ; also sheet 12,14,15
Y3_N: Q17.D ; also sheet 12,14,15
Y4_N: Q18.D ; also sheet 12,14,15
Y5_N: Q19.D ; also sheet 12,14,15
Y6_N: Q20.D ; also sheet 12,14,15
Y7_N: Q21.D ; also sheet 12,14,15

### Notes on the sheet
- Pull ups done on AND page

## Library data of the parts
C1-C5 C7-C10 = MyLib:C_P2INCH
C6 = MyLib:POLARISED_CAP_2P5
D1-D59 D61-D63 D67-D69 D73-D75 D79-D81 D85-D87 D94-D99 D103-D108 D112-D117 D121-D126 D130-D135 D139-D153 D155-D161 D163-D170 = MyLib:L-1334SRT
H1 H2 HOLE1-HOLE6 = MyLib:3M_MOUNT_HOLE
J1-J3 = MyLib:20_HDR_LOCKING_RA
J4 = MyLib:30_HDR_LOCKING_RA
PP1 PP2 = MyLib:POWER_PAD
Q1-Q94 Q99-Q103 Q109-Q113 Q119-Q123 Q129-Q133 Q142-Q147 Q151-Q156 Q160-Q165 Q169-Q174 Q178-Q183 Q187-Q208 = MyLib:2N7000
R1-R7 R9-R23 R26-R41 R43-R55 R61-R75 R80-R118 R121-R125 R131-R135 R141-R145 R156-R165 R171-R180 R186-R195 R201-R210 R216-R225 R231-R256 R259-R267 R269-R275 R277-R284 = MyLib:R_P2INCH
TP1-TP7 = MyLib:TEST_LOOP